# Altium project 724452_RPL-HX_Mobile_AEP_Rev0p91.PrjPcb (part 4 of 13)

## Sheet 0021_Processor PD BOM -.SchDoc
size A3
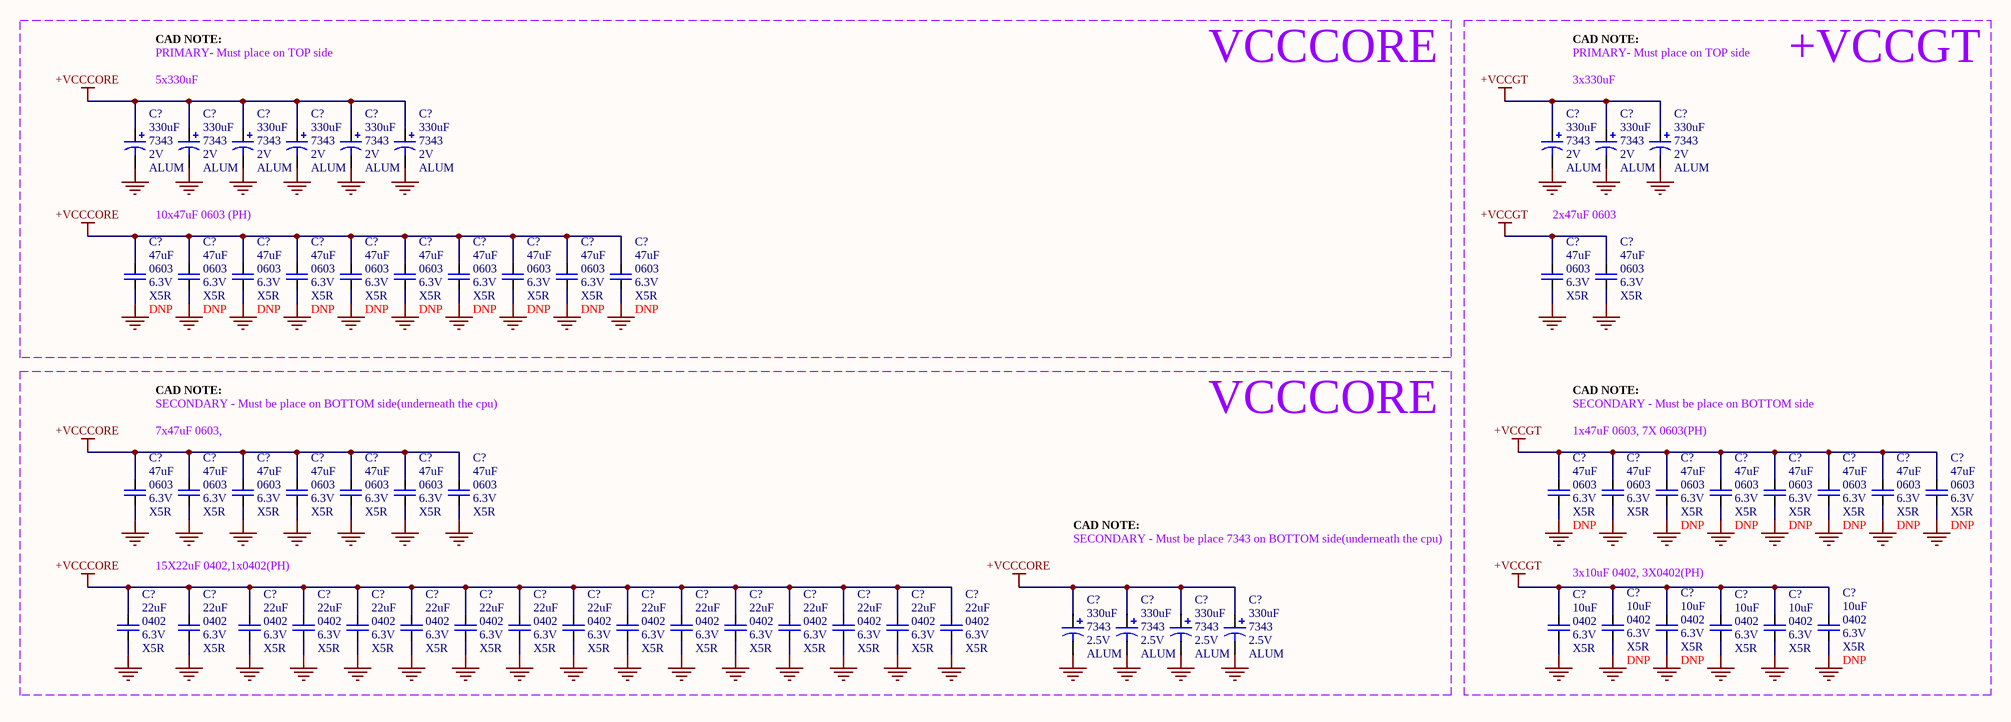
[diagram p47: 0021_Processor PD BOM -.SchDoc]

### Parts
(Parts that share a designator on the sheet are numbered #1, #2 ... from top to bottom, then left to right.)
C?#18  value 330uF  Case/Package: 7343  Voltage: 2V  Dielectric: ALUM  [CAPC_CASE-D2_7343_1.5]  (hidden comment: cap_polar)
C?#19  value 330uF  Case/Package: 7343  Voltage: 2V  Dielectric: ALUM  [CAPC_CASE-D2_7343_1.5]  (hidden comment: cap_polar)
C?#20  value 330uF  Case/Package: 7343  Voltage: 2V  Dielectric: ALUM  [CAPC_CASE-D2_7343_1.5]  (hidden comment: cap_polar)
C?#21  value 330uF  Case/Package: 7343  Voltage: 2V  Dielectric: ALUM  [CAPC_CASE-D2_7343_1.5]  (hidden comment: cap_polar)
C?#22  value 330uF  Case/Package: 7343  Voltage: 2V  Dielectric: ALUM  [CAPC_CASE-D2_7343_1.5]  (hidden comment: cap_polar)
C?#23  value 330uF  Case/Package: 7343  Voltage: 2V  Dielectric: ALUM  [CAPC_CASE-D2_7343_1.5]  (hidden comment: cap_polar)
C?#24  value 330uF  Case/Package: 7343  Voltage: 2V  Dielectric: ALUM  [CAPC_CASE-D2_7343_1.5]  (hidden comment: cap_polar)
C?#25  value 330uF  Case/Package: 7343  Voltage: 2V  Dielectric: ALUM  [CAPC_CASE-D2_7343_1.5]  (hidden comment: cap_polar)
C?#26  value 330uF  Case/Package: 7343  Voltage: 2V  Dielectric: ALUM  [CAPC_CASE-D2_7343_1.5]  (hidden comment: cap_polar)
C?#27  value 47uF  Case/Package: 0603  Voltage: 6.3V  Dielectric: X5R  [capc0603]
C?#28  value 47uF  Case/Package: 0603  Voltage: 6.3V  Dielectric: X5R  [capc0603]
C?#29  value 47uF  Case/Package: 0603  Voltage: 6.3V  Dielectric: X5R  [capc0603]
C?#30  value 47uF  Case/Package: 0603  Voltage: 6.3V  Dielectric: X5R  [capc0603]
C?#31  value 47uF  Case/Package: 0603  Voltage: 6.3V  Dielectric: X5R  [capc0603]
C?#32  value 47uF  Case/Package: 0603  Voltage: 6.3V  Dielectric: X5R  [capc0603]
C?#33  value 47uF  Case/Package: 0603  Voltage: 6.3V  Dielectric: X5R  [capc0603]
C?#34  value 47uF  Case/Package: 0603  Voltage: 6.3V  Dielectric: X5R  [capc0603]
C?#35  value 47uF  Case/Package: 0603  Voltage: 6.3V  Dielectric: X5R  [capc0603]
C?#36  value 47uF  Case/Package: 0603  Voltage: 6.3V  Dielectric: X5R  [capc0603]
C?#37  value 47uF  Case/Package: 0603  Voltage: 6.3V  Dielectric: X5R  [capc0603]
C?#38  value 47uF  Case/Package: 0603  Voltage: 6.3V  Dielectric: X5R  [capc0603]
C?#39  value 47uF  Case/Package: 0603  Voltage: 6.3V  Dielectric: X5R  [capc0603]
C?#40  value 47uF  Case/Package: 0603  Voltage: 6.3V  Dielectric: X5R  [capc0603]
C?#41  value 47uF  Case/Package: 0603  Voltage: 6.3V  Dielectric: X5R  [capc0603]
C?#42  value 47uF  Case/Package: 0603  Voltage: 6.3V  Dielectric: X5R  [capc0603]
C?#43  value 47uF  Case/Package: 0603  Voltage: 6.3V  Dielectric: X5R  [capc0603]
C?#44  value 47uF  Case/Package: 0603  Voltage: 6.3V  Dielectric: X5R  [capc0603]
C?#45  value 47uF  Case/Package: 0603  Voltage: 6.3V  Dielectric: X5R  [capc0603]
C?#46  value 47uF  Case/Package: 0603  Voltage: 6.3V  Dielectric: X5R  [capc0603]
C?#47  value 47uF  Case/Package: 0603  Voltage: 6.3V  Dielectric: X5R  [capc0603]
C?#48  value 47uF  Case/Package: 0603  Voltage: 6.3V  Dielectric: X5R  [capc0603]
C?#49  value 47uF  Case/Package: 0603  Voltage: 6.3V  Dielectric: X5R  [capc0603]
C?#50  value 47uF  Case/Package: 0603  Voltage: 6.3V  Dielectric: X5R  [capc0603]
C?#51  value 47uF  Case/Package: 0603  Voltage: 6.3V  Dielectric: X5R  [capc0603]
C?#52  value 47uF  Case/Package: 0603  Voltage: 6.3V  Dielectric: X5R  [capc0603]
C?#53  value 47uF  Case/Package: 0603  Voltage: 6.3V  Dielectric: X5R  [capc0603]
C?#54  value 330uF  Case/Package: 7343  Voltage: 2.5V  Dielectric: ALUM  [CAPC_CASE-D2_7343_1.5]  (hidden comment: cap_polar)
C?#55  value 330uF  Case/Package: 7343  Voltage: 2.5V  Dielectric: ALUM  [CAPC_CASE-D2_7343_1.5]  (hidden comment: cap_polar)
C?#56  value 330uF  Case/Package: 7343  Voltage: 2.5V  Dielectric: ALUM  [CAPC_CASE-D2_7343_1.5]  (hidden comment: cap_polar)
C?#57  value 330uF  Case/Package: 7343  Voltage: 2.5V  Dielectric: ALUM  [CAPC_CASE-D2_7343_1.5]  (hidden comment: cap_polar)
C?#58  value 22uF  Case/Package: 0402  Voltage: 6.3V  Dielectric: X5R  [CAPC0402]
C?#59  value 22uF  Case/Package: 0402  Voltage: 6.3V  Dielectric: X5R  [CAPC0402]
C?#60  value 22uF  Case/Package: 0402  Voltage: 6.3V  Dielectric: X5R  [CAPC0402]
C?#61  value 22uF  Case/Package: 0402  Voltage: 6.3V  Dielectric: X5R  [CAPC0402]
C?#62  value 22uF  Case/Package: 0402  Voltage: 6.3V  Dielectric: X5R  [CAPC0402]
C?#63  value 22uF  Case/Package: 0402  Voltage: 6.3V  Dielectric: X5R  [CAPC0402]
C?#64  value 22uF  Case/Package: 0402  Voltage: 6.3V  Dielectric: X5R  [CAPC0402]
C?#65  value 22uF  Case/Package: 0402  Voltage: 6.3V  Dielectric: X5R  [CAPC0402]
C?#66  value 22uF  Case/Package: 0402  Voltage: 6.3V  Dielectric: X5R  [CAPC0402]
C?#67  value 22uF  Case/Package: 0402  Voltage: 6.3V  Dielectric: X5R  [CAPC0402]
C?#68  value 22uF  Case/Package: 0402  Voltage: 6.3V  Dielectric: X5R  [CAPC0402]
C?#69  value 22uF  Case/Package: 0402  Voltage: 6.3V  Dielectric: X5R  [CAPC0402]
C?#70  value 22uF  Case/Package: 0402  Voltage: 6.3V  Dielectric: X5R  [CAPC0402]
C?#71  value 22uF  Case/Package: 0402  Voltage: 6.3V  Dielectric: X5R  [CAPC0402]
C?#72  value 22uF  Case/Package: 0402  Voltage: 6.3V  Dielectric: X5R  [CAPC0402]
C?#73  value 22uF  Case/Package: 0402  Voltage: 6.3V  Dielectric: X5R  [CAPC0402]
C?#74  value 10uF  Case/Package: 0402  Voltage: 6.3V  Dielectric: X5R  [CAPC0402]
C?#75  value 10uF  Case/Package: 0402  Voltage: 6.3V  Dielectric: X5R  [CAPC0402]
C?#76  value 10uF  Case/Package: 0402  Voltage: 6.3V  Dielectric: X5R  [CAPC0402]
C?#77  value 10uF  Case/Package: 0402  Voltage: 6.3V  Dielectric: X5R  [CAPC0402]
C?#78  value 10uF  Case/Package: 0402  Voltage: 6.3V  Dielectric: X5R  [CAPC0402]
C?#79  value 10uF  Case/Package: 0402  Voltage: 6.3V  Dielectric: X5R  [CAPC0402]

### Nets
+VCCCORE: C?#18.1(+) C?#19.1(+) C?#20.1(+) C?#21.1(+) C?#22.1(+) C?#23.1(+) C?#27.1 C?#28.1 C?#29.1 C?#30.1 C?#31.1 C?#32.1 C?#33.1 C?#34.1 C?#35.1 C?#36.1 C?#39.1 C?#40.1 C?#41.1 C?#42.1 C?#43.1 C?#44.1 C?#45.1 C?#54.1(+) C?#55.1(+) C?#56.1(+) C?#57.1(+) C?#58.1 C?#59.1 C?#60.1 C?#61.1 C?#62.1 C?#63.1 C?#64.1 C?#65.1 C?#66.1 C?#67.1 C?#68.1 C?#69.1 C?#70.1 C?#71.1 C?#72.1 C?#73.1
+VCCGT: C?#24.1(+) C?#25.1(+) C?#26.1(+) C?#37.1 C?#38.1 C?#46.1 C?#47.1 C?#48.1 C?#49.1 C?#50.1 C?#51.1 C?#52.1 C?#53.1 C?#74.1 C?#75.1 C?#76.1 C?#77.1 C?#78.1 C?#79.1
GND: C?#18.2 C?#19.2 C?#20.2 C?#21.2 C?#22.2 C?#23.2 C?#24.2 C?#25.2 C?#26.2 C?#27.2 C?#28.2 C?#29.2 C?#30.2 C?#31.2 C?#32.2 C?#33.2 C?#34.2 C?#35.2 C?#36.2 C?#37.2 C?#38.2 C?#39.2 C?#40.2 C?#41.2 C?#42.2 C?#43.2 C?#44.2 C?#45.2 C?#46.2 C?#47.2 C?#48.2 C?#49.2 C?#50.2 C?#51.2 C?#52.2 C?#53.2 C?#54.2 C?#55.2 C?#56.2 C?#57.2 C?#58.2 C?#59.2 C?#60.2 C?#61.2 C?#62.2 C?#63.2 C?#64.2 C?#65.2 C?#66.2 C?#67.2 C?#68.2 C?#69.2 C?#70.2 C?#71.2 C?#72.2 C?#73.2 C?#74.2 C?#75.2 C?#76.2 C?#77.2 C?#78.2 C?#79.2  [project net EXP_A_RX_4_DP]

### Notes on the sheet
- CAD NOTE:
- PRIMARY- Must place on TOP side
- 5x330uF
- VCCCORE
- 3x330uF
- +VCCGT
- (near C?#28) 10x47uF 0603 (PH)
- (near C?#37) 2x47uF 0603
- SECONDARY - Must be place on BOTTOM side(underneath the cpu)
- (near C?#40) 7x47uF 0603,
- (near C?#48) 1x47uF 0603, 7X 0603(PH)
- SECONDARY - Must be place on BOTTOM side
- (near C?#59) 15X22uF 0402,1x0402(PH)
- SECONDARY - Must be place 7343 on BOTTOM side(underneath the cpu)
- (near C?#75) 3x10uF 0402, 3X0402(PH)

### Library data of the parts
C?#18-C?#26 = cap_polar: CAP ALUM POLY 330UF 2V 7343; Manufacturer Part Number: EEF-ST0D331R; Type: Polymer
C?#27-C?#53 = Cap: CAP CER 47uF 6.3V X5R 0603
  C?#27-C?#36 C?#46 C?#48-C?#53: DNP: DNP
C?#54-C?#57 = cap_polar: CAP ALUM POLY 330UF 2.5V 7343; Manufacturer Part Number: EEF-ST0D331R; Type: Polymer
C?#58-C?#79 = Cap: CAP CER 10uF 6.3V X5R 0402
  C?#75 C?#76 C?#79: DNP: DNP

## Sheet 0022_Processor - CPU ST.SchDoc
size A3
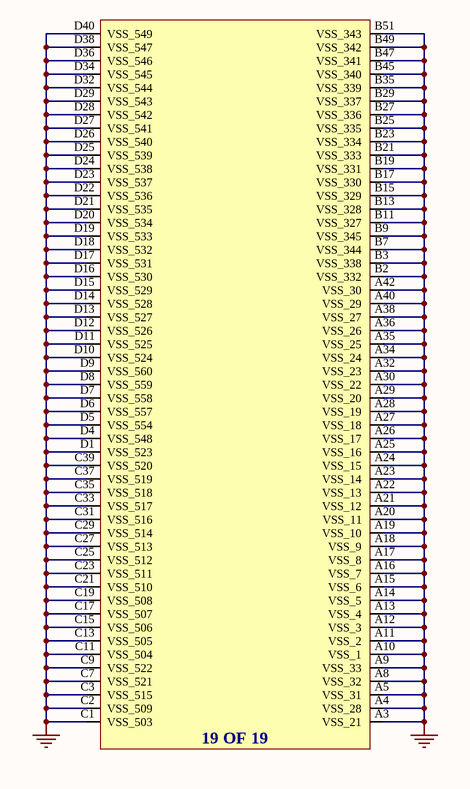
[diagram p48: 0022_Processor - CPU ST.SchDoc]

### Parts
U1401  C_RPL_HX_EXT  (value not drawn)  (part S of 19)

### Nets
GND: U1401.A3(VSS_21) U1401.A4(VSS_28) U1401.A5(VSS_31) U1401.A8(VSS_32) U1401.A9(VSS_33) U1401.A10(VSS_1) U1401.A11(VSS_2) U1401.A12(VSS_3) U1401.A13(VSS_4) U1401.A14(VSS_5) U1401.A15(VSS_6) U1401.A16(VSS_7) U1401.A17(VSS_8) U1401.A18(VSS_9) U1401.A19(VSS_10) U1401.A20(VSS_11) U1401.A21(VSS_12) U1401.A22(VSS_13) U1401.A23(VSS_14) U1401.A24(VSS_15) U1401.A25(VSS_16) U1401.A26(VSS_17) U1401.A27(VSS_18) U1401.A28(VSS_19) U1401.A29(VSS_20) U1401.A30(VSS_22) U1401.A32(VSS_23) U1401.A34(VSS_24) U1401.A35(VSS_25) U1401.A36(VSS_26) U1401.A38(VSS_27) U1401.A40(VSS_29) U1401.A42(VSS_30) U1401.B2(VSS_332) U1401.B3(VSS_338) U1401.B7(VSS_344) U1401.B9(VSS_345) U1401.B11(VSS_327) U1401.B13(VSS_328) U1401.B15(VSS_329) U1401.B17(VSS_330) U1401.B19(VSS_331) U1401.B21(VSS_333) U1401.B23(VSS_334) U1401.B25(VSS_335) U1401.B27(VSS_336) U1401.B29(VSS_337) U1401.B35(VSS_339) U1401.B45(VSS_340) U1401.B47(VSS_341) U1401.B49(VSS_342) U1401.B51(VSS_343) U1401.C1(VSS_503) U1401.C2(VSS_509) U1401.C3(VSS_515) U1401.C7(VSS_521) U1401.C9(VSS_522) U1401.C11(VSS_504) U1401.C13(VSS_505) U1401.C15(VSS_506) U1401.C17(VSS_507) U1401.C19(VSS_508) U1401.C21(VSS_510) U1401.C23(VSS_511) U1401.C25(VSS_512) U1401.C27(VSS_513) U1401.C29(VSS_514) U1401.C31(VSS_516) U1401.C33(VSS_517) U1401.C35(VSS_518) U1401.C37(VSS_519) U1401.C39(VSS_520) U1401.D1(VSS_523) U1401.D4(VSS_548) U1401.D5(VSS_554) U1401.D6(VSS_557) U1401.D7(VSS_558) U1401.D8(VSS_559) U1401.D9(VSS_560) U1401.D10(VSS_524) U1401.D11(VSS_525) U1401.D12(VSS_526) U1401.D13(VSS_527) U1401.D14(VSS_528) U1401.D15(VSS_529) U1401.D16(VSS_530) U1401.D17(VSS_531) U1401.D18(VSS_532) U1401.D19(VSS_533) U1401.D20(VSS_534) U1401.D21(VSS_535) U1401.D22(VSS_536) U1401.D23(VSS_537) U1401.D24(VSS_538) U1401.D25(VSS_539) U1401.D26(VSS_540) U1401.D27(VSS_541) U1401.D28(VSS_542) U1401.D29(VSS_543) U1401.D32(VSS_544) U1401.D34(VSS_545) U1401.D36(VSS_546) U1401.D38(VSS_547) U1401.D40(VSS_549)  [project net EXP_A_RX_4_DP]

### Notes on the sheet
- (in symbol C_RPL_HX_EXT, part S) 19 OF 19

## Sheet 0024_DDR5 SODIMM CONTRO.SchDoc
size A3
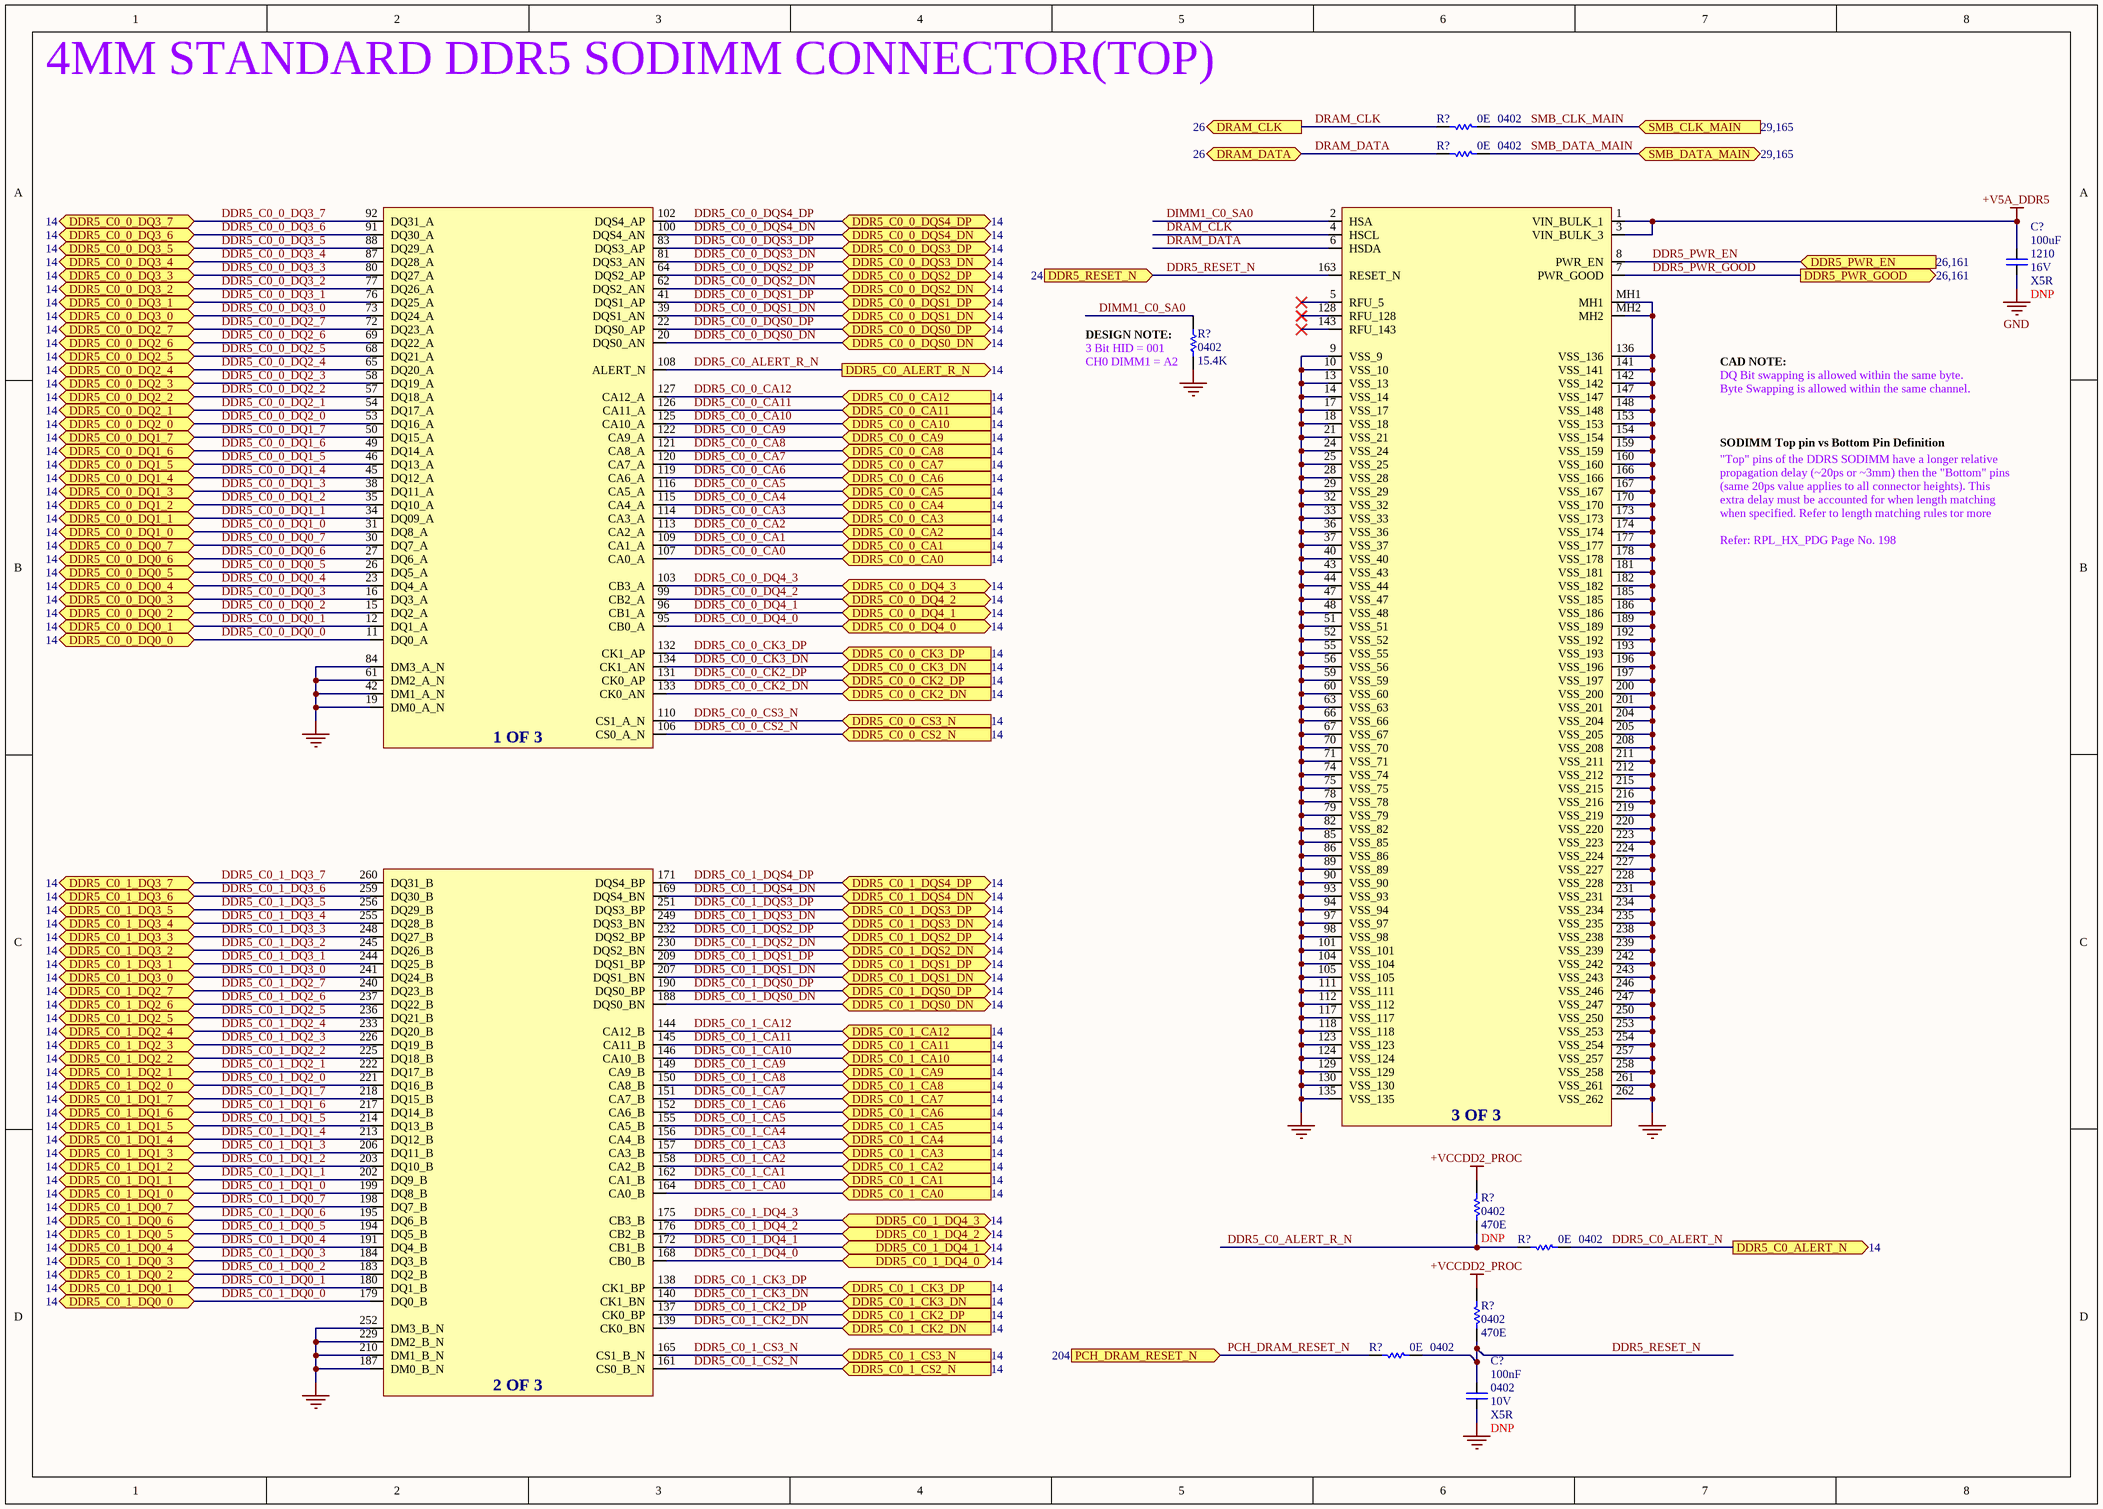
[diagram p49: 0024_DDR5 SODIMM CONTRO.SchDoc]

### Parts
(Parts that share a designator on the sheet are numbered #1, #2 ... from top to bottom, then left to right.)
C?#80  value 100uF  Case/Package: 1210  Voltage: 16V  Dielectric: X5R
C?#81  value 100nF  Case/Package: 0402  Voltage: 10V  Dielectric: X5R  [CAPC0402]
J2301  C_DDR5_SODIMM_2X131_2EM  (value not drawn)  (parts A,B,C of 3)
R?#43  value 0E  Case/Package: 0402  [RESC0402]  (hidden comment: Res)
R?#44  value 0E  Case/Package: 0402  [RESC0402]  (hidden comment: Res)
R?#45  value 15.4K  Case/Package: 0402  [RESC0402]  (hidden comment: Res)
R?#46  value 470E  Case/Package: 0402  [RESC0402]  (hidden comment: Res)
R?#47  value 0E  Case/Package: 0402  [RESC0402]  (hidden comment: Res)
R?#48  value 470E  Case/Package: 0402  [RESC0402]  (hidden comment: Res)
R?#49  value 0E  Case/Package: 0402  [RESC0402]  (hidden comment: Res)

### Ports
DDR5_C0_0_CA0 (in), DDR5_C0_0_CA1 (in), DDR5_C0_0_CA2 (in), DDR5_C0_0_CA3 (in), DDR5_C0_0_CA4 (in), DDR5_C0_0_CA5 (in), DDR5_C0_0_CA6 (in), DDR5_C0_0_CA7 (in), DDR5_C0_0_CA8 (in), DDR5_C0_0_CA9 (in), DDR5_C0_0_CA10 (in), DDR5_C0_0_CA11 (in), DDR5_C0_0_CA12 (in), DDR5_C0_0_CK2_DN (in), DDR5_C0_0_CK2_DP (in), DDR5_C0_0_CK3_DN (in), DDR5_C0_0_CK3_DP (in), DDR5_C0_0_CS2_N (in), DDR5_C0_0_CS3_N (in), DDR5_C0_0_DQ0_0 (bidir), DDR5_C0_0_DQ0_1 (bidir), DDR5_C0_0_DQ0_2 (bidir), DDR5_C0_0_DQ0_3 (bidir), DDR5_C0_0_DQ0_4 (bidir), DDR5_C0_0_DQ0_5 (bidir), DDR5_C0_0_DQ0_6 (bidir), DDR5_C0_0_DQ0_7 (bidir), DDR5_C0_0_DQ1_0 (bidir), DDR5_C0_0_DQ1_1 (bidir), DDR5_C0_0_DQ1_2 (bidir), DDR5_C0_0_DQ1_3 (bidir), DDR5_C0_0_DQ1_4 (bidir), DDR5_C0_0_DQ1_5 (bidir), DDR5_C0_0_DQ1_6 (bidir), DDR5_C0_0_DQ1_7 (bidir), DDR5_C0_0_DQ2_0 (bidir), DDR5_C0_0_DQ2_1 (bidir), DDR5_C0_0_DQ2_2 (bidir), DDR5_C0_0_DQ2_3 (bidir), DDR5_C0_0_DQ2_4 (bidir), DDR5_C0_0_DQ2_5 (bidir), DDR5_C0_0_DQ2_6 (bidir), DDR5_C0_0_DQ2_7 (bidir), DDR5_C0_0_DQ3_0 (bidir), DDR5_C0_0_DQ3_1 (bidir), DDR5_C0_0_DQ3_2 (bidir), DDR5_C0_0_DQ3_3 (bidir), DDR5_C0_0_DQ3_4 (bidir), DDR5_C0_0_DQ3_5 (bidir), DDR5_C0_0_DQ3_6 (bidir), DDR5_C0_0_DQ3_7 (bidir), DDR5_C0_0_DQ4_0 (bidir), DDR5_C0_0_DQ4_1 (bidir), DDR5_C0_0_DQ4_2 (bidir), DDR5_C0_0_DQ4_3 (bidir), DDR5_C0_0_DQS0_DN (bidir), DDR5_C0_0_DQS0_DP (bidir), DDR5_C0_0_DQS1_DN (bidir), DDR5_C0_0_DQS1_DP (bidir), DDR5_C0_0_DQS2_DN (bidir), DDR5_C0_0_DQS2_DP (bidir), DDR5_C0_0_DQS3_DN (bidir), DDR5_C0_0_DQS3_DP (bidir), DDR5_C0_0_DQS4_DN (bidir), DDR5_C0_0_DQS4_DP (bidir), DDR5_C0_1_CA0 (in), DDR5_C0_1_CA1 (in), DDR5_C0_1_CA2 (in), DDR5_C0_1_CA3 (in), DDR5_C0_1_CA4 (in), DDR5_C0_1_CA5 (in), DDR5_C0_1_CA6 (in), DDR5_C0_1_CA7 (in), DDR5_C0_1_CA8 (in), DDR5_C0_1_CA9 (in), DDR5_C0_1_CA10 (in), DDR5_C0_1_CA11 (in), DDR5_C0_1_CA12 (in), DDR5_C0_1_CK2_DN (in), DDR5_C0_1_CK2_DP (in), DDR5_C0_1_CK3_DN (in), DDR5_C0_1_CK3_DP (in), DDR5_C0_1_CS2_N (in), DDR5_C0_1_CS3_N (in), DDR5_C0_1_DQ0_0 (bidir), DDR5_C0_1_DQ0_1 (bidir), DDR5_C0_1_DQ0_2 (bidir), DDR5_C0_1_DQ0_3 (bidir), DDR5_C0_1_DQ0_4 (bidir), DDR5_C0_1_DQ0_5 (bidir), DDR5_C0_1_DQ0_6 (bidir), DDR5_C0_1_DQ0_7 (bidir), DDR5_C0_1_DQ1_0 (bidir), DDR5_C0_1_DQ1_1 (bidir), DDR5_C0_1_DQ1_2 (bidir), DDR5_C0_1_DQ1_3 (bidir), DDR5_C0_1_DQ1_4 (bidir), DDR5_C0_1_DQ1_5 (bidir), DDR5_C0_1_DQ1_6 (bidir), DDR5_C0_1_DQ1_7 (bidir), DDR5_C0_1_DQ2_0 (bidir), DDR5_C0_1_DQ2_1 (bidir), DDR5_C0_1_DQ2_2 (bidir), DDR5_C0_1_DQ2_3 (bidir), DDR5_C0_1_DQ2_4 (bidir), DDR5_C0_1_DQ2_5 (bidir), DDR5_C0_1_DQ2_6 (bidir), DDR5_C0_1_DQ2_7 (bidir), DDR5_C0_1_DQ3_0 (bidir), DDR5_C0_1_DQ3_1 (bidir), DDR5_C0_1_DQ3_2 (bidir), DDR5_C0_1_DQ3_3 (bidir), DDR5_C0_1_DQ3_4 (bidir), DDR5_C0_1_DQ3_5 (bidir), DDR5_C0_1_DQ3_6 (bidir), DDR5_C0_1_DQ3_7 (bidir), DDR5_C0_1_DQ4_0 (bidir), DDR5_C0_1_DQ4_1 (bidir), DDR5_C0_1_DQ4_2 (bidir), DDR5_C0_1_DQ4_3 (bidir), DDR5_C0_1_DQS0_DN (bidir), DDR5_C0_1_DQS0_DP (bidir), DDR5_C0_1_DQS1_DN (bidir), DDR5_C0_1_DQS1_DP (bidir), DDR5_C0_1_DQS2_DN (bidir), DDR5_C0_1_DQS2_DP (bidir), DDR5_C0_1_DQS3_DN (bidir), DDR5_C0_1_DQS3_DP (bidir), DDR5_C0_1_DQS4_DN (bidir), DDR5_C0_1_DQS4_DP (bidir), DDR5_C0_ALERT_N (out), DDR5_C0_ALERT_R_N (out), DDR5_PWR_EN (in), DDR5_PWR_GOOD (out), DDR5_RESET_N (in), DRAM_CLK (out), DRAM_DATA (bidir), PCH_DRAM_RESET_N (in), SMB_CLK_MAIN (in), SMB_DATA_MAIN (bidir)

### Nets
+V5A_DDR5: C?#80.1 J2301.1(VIN_BULK_1) J2301.3(VIN_BULK_3)
+VCCDD2_PROC: R?#46.2 R?#48.2
GND: C?#80.2 C?#81.2 J2301.9(VSS_9) J2301.10(VSS_10) J2301.13(VSS_13) J2301.14(VSS_14) J2301.17(VSS_17) J2301.18(VSS_18) J2301.19(DM0_A_N) J2301.21(VSS_21) J2301.24(VSS_24) J2301.25(VSS_25) J2301.28(VSS_28) J2301.29(VSS_29) J2301.32(VSS_32) J2301.33(VSS_33) J2301.36(VSS_36) J2301.37(VSS_37) J2301.40(VSS_40) J2301.42(DM1_A_N) J2301.43(VSS_43) J2301.44(VSS_44) J2301.47(VSS_47) J2301.48(VSS_48) J2301.51(VSS_51) J2301.52(VSS_52) J2301.55(VSS_55) J2301.56(VSS_56) J2301.59(VSS_59) J2301.60(VSS_60) J2301.61(DM2_A_N) J2301.63(VSS_63) J2301.66(VSS_66) J2301.67(VSS_67) J2301.70(VSS_70) J2301.71(VSS_71) J2301.74(VSS_74) J2301.75(VSS_75) J2301.78(VSS_78) J2301.79(VSS_79) J2301.82(VSS_82) J2301.84(DM3_A_N) J2301.85(VSS_85) J2301.86(VSS_86) J2301.89(VSS_89) J2301.90(VSS_90) J2301.93(VSS_93) J2301.94(VSS_94) J2301.97(VSS_97) J2301.98(VSS_98) J2301.101(VSS_101) J2301.104(VSS_104) J2301.105(VSS_105) J2301.111(VSS_111) J2301.112(VSS_112) J2301.117(VSS_117) J2301.118(VSS_118) J2301.123(VSS_123) J2301.124(VSS_124) J2301.129(VSS_129) J2301.130(VSS_130) J2301.135(VSS_135) J2301.136(VSS_136) J2301.141(VSS_141) J2301.142(VSS_142) J2301.147(VSS_147) J2301.148(VSS_148) J2301.153(VSS_153) J2301.154(VSS_154) J2301.159(VSS_159) J2301.160(VSS_160) J2301.166(VSS_166) J2301.167(VSS_167) J2301.170(VSS_170) J2301.173(VSS_173) J2301.174(VSS_174) J2301.177(VSS_177) J2301.178(VSS_178) J2301.181(VSS_181) J2301.182(VSS_182) J2301.185(VSS_185) J2301.186(VSS_186) J2301.187(DM0_B_N) J2301.189(VSS_189) J2301.192(VSS_192) J2301.193(VSS_193) J2301.196(VSS_196) J2301.197(VSS_197) J2301.200(VSS_200) J2301.201(VSS_201) J2301.204(VSS_204) J2301.205(VSS_205) J2301.208(VSS_208) J2301.210(DM1_B_N) J2301.211(VSS_211) J2301.212(VSS_212) J2301.215(VSS_215) J2301.216(VSS_216) J2301.219(VSS_219) J2301.220(VSS_220) J2301.223(VSS_223) J2301.224(VSS_224) J2301.227(VSS_227) J2301.228(VSS_228) J2301.229(DM2_B_N) J2301.231(VSS_231) J2301.234(VSS_234) J2301.235(VSS_235) J2301.238(VSS_238) J2301.239(VSS_239) J2301.242(VSS_242) J2301.243(VSS_243) J2301.246(VSS_246) J2301.247(VSS_247) J2301.250(VSS_250) J2301.252(DM3_B_N) J2301.253(VSS_253) J2301.254(VSS_254) J2301.257(VSS_257) J2301.258(VSS_258) J2301.261(VSS_261) J2301.262(VSS_262) J2301.MH1 J2301.MH2 R?#45.2  [project net EXP_A_RX_4_DP]
DDR5_C0_0_CA0: J2301.107(CA0_A) ; port DDR5_C0_0_CA0
DDR5_C0_0_CA1: J2301.109(CA1_A) ; port DDR5_C0_0_CA1
DDR5_C0_0_CA2: J2301.113(CA2_A) ; port DDR5_C0_0_CA2
DDR5_C0_0_CA3: J2301.114(CA3_A) ; port DDR5_C0_0_CA3
DDR5_C0_0_CA4: J2301.115(CA4_A) ; port DDR5_C0_0_CA4
DDR5_C0_0_CA5: J2301.116(CA5_A) ; port DDR5_C0_0_CA5
DDR5_C0_0_CA6: J2301.119(CA6_A) ; port DDR5_C0_0_CA6
DDR5_C0_0_CA7: J2301.120(CA7_A) ; port DDR5_C0_0_CA7
DDR5_C0_0_CA8: J2301.121(CA8_A) ; port DDR5_C0_0_CA8
DDR5_C0_0_CA9: J2301.122(CA9_A) ; port DDR5_C0_0_CA9
DDR5_C0_0_CA10: J2301.125(CA10_A) ; port DDR5_C0_0_CA10
DDR5_C0_0_CA11: J2301.126(CA11_A) ; port DDR5_C0_0_CA11
DDR5_C0_0_CA12: J2301.127(CA12_A) ; port DDR5_C0_0_CA12
DDR5_C0_0_CK2_DN: J2301.133(CK0_AN) ; port DDR5_C0_0_CK2_DN
DDR5_C0_0_CK2_DP: J2301.131(CK0_AP) ; port DDR5_C0_0_CK2_DP
DDR5_C0_0_CK3_DN: J2301.134(CK1_AN) ; port DDR5_C0_0_CK3_DN
DDR5_C0_0_CK3_DP: J2301.132(CK1_AP) ; port DDR5_C0_0_CK3_DP
DDR5_C0_0_CS2_N: J2301.106(CS0_A_N) ; port DDR5_C0_0_CS2_N
DDR5_C0_0_CS3_N: J2301.110(CS1_A_N) ; port DDR5_C0_0_CS3_N
DDR5_C0_0_DQ0_0: J2301.11(DQ0_A) ; port DDR5_C0_0_DQ0_0
DDR5_C0_0_DQ0_1: J2301.12(DQ1_A) ; port DDR5_C0_0_DQ0_1
DDR5_C0_0_DQ0_2: J2301.15(DQ2_A) ; port DDR5_C0_0_DQ0_2
DDR5_C0_0_DQ0_3: J2301.16(DQ3_A) ; port DDR5_C0_0_DQ0_3
DDR5_C0_0_DQ0_4: J2301.23(DQ4_A) ; port DDR5_C0_0_DQ0_4
DDR5_C0_0_DQ0_5: J2301.26(DQ5_A) ; port DDR5_C0_0_DQ0_5
DDR5_C0_0_DQ0_6: J2301.27(DQ6_A) ; port DDR5_C0_0_DQ0_6
DDR5_C0_0_DQ0_7: J2301.30(DQ7_A) ; port DDR5_C0_0_DQ0_7
DDR5_C0_0_DQ1_0: J2301.31(DQ8_A) ; port DDR5_C0_0_DQ1_0
DDR5_C0_0_DQ1_1: J2301.34(DQ09_A) ; port DDR5_C0_0_DQ1_1
DDR5_C0_0_DQ1_2: J2301.35(DQ10_A) ; port DDR5_C0_0_DQ1_2
DDR5_C0_0_DQ1_3: J2301.38(DQ11_A) ; port DDR5_C0_0_DQ1_3
DDR5_C0_0_DQ1_4: J2301.45(DQ12_A) ; port DDR5_C0_0_DQ1_4
DDR5_C0_0_DQ1_5: J2301.46(DQ13_A) ; port DDR5_C0_0_DQ1_5
DDR5_C0_0_DQ1_6: J2301.49(DQ14_A) ; port DDR5_C0_0_DQ1_6
DDR5_C0_0_DQ1_7: J2301.50(DQ15_A) ; port DDR5_C0_0_DQ1_7
DDR5_C0_0_DQ2_0: J2301.53(DQ16_A) ; port DDR5_C0_0_DQ2_0
DDR5_C0_0_DQ2_1: J2301.54(DQ17_A) ; port DDR5_C0_0_DQ2_1
DDR5_C0_0_DQ2_2: J2301.57(DQ18_A) ; port DDR5_C0_0_DQ2_2
DDR5_C0_0_DQ2_3: J2301.58(DQ19_A) ; port DDR5_C0_0_DQ2_3
DDR5_C0_0_DQ2_4: J2301.65(DQ20_A) ; port DDR5_C0_0_DQ2_4
DDR5_C0_0_DQ2_5: J2301.68(DQ21_A) ; port DDR5_C0_0_DQ2_5
DDR5_C0_0_DQ2_6: J2301.69(DQ22_A) ; port DDR5_C0_0_DQ2_6
DDR5_C0_0_DQ2_7: J2301.72(DQ23_A) ; port DDR5_C0_0_DQ2_7
DDR5_C0_0_DQ3_0: J2301.73(DQ24_A) ; port DDR5_C0_0_DQ3_0
DDR5_C0_0_DQ3_1: J2301.76(DQ25_A) ; port DDR5_C0_0_DQ3_1
DDR5_C0_0_DQ3_2: J2301.77(DQ26_A) ; port DDR5_C0_0_DQ3_2
DDR5_C0_0_DQ3_3: J2301.80(DQ27_A) ; port DDR5_C0_0_DQ3_3
DDR5_C0_0_DQ3_4: J2301.87(DQ28_A) ; port DDR5_C0_0_DQ3_4
DDR5_C0_0_DQ3_5: J2301.88(DQ29_A) ; port DDR5_C0_0_DQ3_5
DDR5_C0_0_DQ3_6: J2301.91(DQ30_A) ; port DDR5_C0_0_DQ3_6
DDR5_C0_0_DQ3_7: J2301.92(DQ31_A) ; port DDR5_C0_0_DQ3_7
DDR5_C0_0_DQ4_0: J2301.95(CB0_A) ; port DDR5_C0_0_DQ4_0
DDR5_C0_0_DQ4_1: J2301.96(CB1_A) ; port DDR5_C0_0_DQ4_1
DDR5_C0_0_DQ4_2: J2301.99(CB2_A) ; port DDR5_C0_0_DQ4_2
DDR5_C0_0_DQ4_3: J2301.103(CB3_A) ; port DDR5_C0_0_DQ4_3
DDR5_C0_0_DQS0_DN: J2301.20(DQS0_AN) ; port DDR5_C0_0_DQS0_DN
DDR5_C0_0_DQS0_DP: J2301.22(DQS0_AP) ; port DDR5_C0_0_DQS0_DP
DDR5_C0_0_DQS1_DN: J2301.39(DQS1_AN) ; port DDR5_C0_0_DQS1_DN
DDR5_C0_0_DQS1_DP: J2301.41(DQS1_AP) ; port DDR5_C0_0_DQS1_DP
DDR5_C0_0_DQS2_DN: J2301.62(DQS2_AN) ; port DDR5_C0_0_DQS2_DN
DDR5_C0_0_DQS2_DP: J2301.64(DQS2_AP) ; port DDR5_C0_0_DQS2_DP
DDR5_C0_0_DQS3_DN: J2301.81(DQS3_AN) ; port DDR5_C0_0_DQS3_DN
DDR5_C0_0_DQS3_DP: J2301.83(DQS3_AP) ; port DDR5_C0_0_DQS3_DP
DDR5_C0_0_DQS4_DN: J2301.100(DQS4_AN) ; port DDR5_C0_0_DQS4_DN
DDR5_C0_0_DQS4_DP: J2301.102(DQS4_AP) ; port DDR5_C0_0_DQS4_DP
DDR5_C0_1_CA0: J2301.164(CA0_B) ; port DDR5_C0_1_CA0
DDR5_C0_1_CA1: J2301.162(CA1_B) ; port DDR5_C0_1_CA1
DDR5_C0_1_CA2: J2301.158(CA2_B) ; port DDR5_C0_1_CA2
DDR5_C0_1_CA3: J2301.157(CA3_B) ; port DDR5_C0_1_CA3
DDR5_C0_1_CA4: J2301.156(CA4_B) ; port DDR5_C0_1_CA4
DDR5_C0_1_CA5: J2301.155(CA5_B) ; port DDR5_C0_1_CA5
DDR5_C0_1_CA6: J2301.152(CA6_B) ; port DDR5_C0_1_CA6
DDR5_C0_1_CA7: J2301.151(CA7_B) ; port DDR5_C0_1_CA7
DDR5_C0_1_CA8: J2301.150(CA8_B) ; port DDR5_C0_1_CA8
DDR5_C0_1_CA9: J2301.149(CA9_B) ; port DDR5_C0_1_CA9
DDR5_C0_1_CA10: J2301.146(CA10_B) ; port DDR5_C0_1_CA10
DDR5_C0_1_CA11: J2301.145(CA11_B) ; port DDR5_C0_1_CA11
DDR5_C0_1_CA12: J2301.144(CA12_B) ; port DDR5_C0_1_CA12
DDR5_C0_1_CK2_DN: J2301.139(CK0_BN) ; port DDR5_C0_1_CK2_DN
DDR5_C0_1_CK2_DP: J2301.137(CK0_BP) ; port DDR5_C0_1_CK2_DP
DDR5_C0_1_CK3_DN: J2301.140(CK1_BN) ; port DDR5_C0_1_CK3_DN
DDR5_C0_1_CK3_DP: J2301.138(CK1_BP) ; port DDR5_C0_1_CK3_DP
DDR5_C0_1_CS2_N: J2301.161(CS0_B_N) ; port DDR5_C0_1_CS2_N
DDR5_C0_1_CS3_N: J2301.165(CS1_B_N) ; port DDR5_C0_1_CS3_N
DDR5_C0_1_DQ0_0: J2301.179(DQ0_B) ; port DDR5_C0_1_DQ0_0
DDR5_C0_1_DQ0_1: J2301.180(DQ1_B) ; port DDR5_C0_1_DQ0_1
DDR5_C0_1_DQ0_2: J2301.183(DQ2_B) ; port DDR5_C0_1_DQ0_2
DDR5_C0_1_DQ0_3: J2301.184(DQ3_B) ; port DDR5_C0_1_DQ0_3
DDR5_C0_1_DQ0_4: J2301.191(DQ4_B) ; port DDR5_C0_1_DQ0_4
DDR5_C0_1_DQ0_5: J2301.194(DQ5_B) ; port DDR5_C0_1_DQ0_5
DDR5_C0_1_DQ0_6: J2301.195(DQ6_B) ; port DDR5_C0_1_DQ0_6
DDR5_C0_1_DQ0_7: J2301.198(DQ7_B) ; port DDR5_C0_1_DQ0_7
DDR5_C0_1_DQ1_0: J2301.199(DQ8_B) ; port DDR5_C0_1_DQ1_0
DDR5_C0_1_DQ1_1: J2301.202(DQ9_B) ; port DDR5_C0_1_DQ1_1
DDR5_C0_1_DQ1_2: J2301.203(DQ10_B) ; port DDR5_C0_1_DQ1_2
DDR5_C0_1_DQ1_3: J2301.206(DQ11_B) ; port DDR5_C0_1_DQ1_3
DDR5_C0_1_DQ1_4: J2301.213(DQ12_B) ; port DDR5_C0_1_DQ1_4
DDR5_C0_1_DQ1_5: J2301.214(DQ13_B) ; port DDR5_C0_1_DQ1_5
DDR5_C0_1_DQ1_6: J2301.217(DQ14_B) ; port DDR5_C0_1_DQ1_6
DDR5_C0_1_DQ1_7: J2301.218(DQ15_B) ; port DDR5_C0_1_DQ1_7
DDR5_C0_1_DQ2_0: J2301.221(DQ16_B) ; port DDR5_C0_1_DQ2_0
DDR5_C0_1_DQ2_1: J2301.222(DQ17_B) ; port DDR5_C0_1_DQ2_1
DDR5_C0_1_DQ2_2: J2301.225(DQ18_B) ; port DDR5_C0_1_DQ2_2
DDR5_C0_1_DQ2_3: J2301.226(DQ19_B) ; port DDR5_C0_1_DQ2_3
DDR5_C0_1_DQ2_4: J2301.233(DQ20_B) ; port DDR5_C0_1_DQ2_4
DDR5_C0_1_DQ2_5: J2301.236(DQ21_B) ; port DDR5_C0_1_DQ2_5
DDR5_C0_1_DQ2_6: J2301.237(DQ22_B) ; port DDR5_C0_1_DQ2_6
DDR5_C0_1_DQ2_7: J2301.240(DQ23_B) ; port DDR5_C0_1_DQ2_7
DDR5_C0_1_DQ3_0: J2301.241(DQ24_B) ; port DDR5_C0_1_DQ3_0
DDR5_C0_1_DQ3_1: J2301.244(DQ25_B) ; port DDR5_C0_1_DQ3_1
DDR5_C0_1_DQ3_2: J2301.245(DQ26_B) ; port DDR5_C0_1_DQ3_2
DDR5_C0_1_DQ3_3: J2301.248(DQ27_B) ; port DDR5_C0_1_DQ3_3
DDR5_C0_1_DQ3_4: J2301.255(DQ28_B) ; port DDR5_C0_1_DQ3_4
DDR5_C0_1_DQ3_5: J2301.256(DQ29_B) ; port DDR5_C0_1_DQ3_5
DDR5_C0_1_DQ3_6: J2301.259(DQ30_B) ; port DDR5_C0_1_DQ3_6
DDR5_C0_1_DQ3_7: J2301.260(DQ31_B) ; port DDR5_C0_1_DQ3_7
DDR5_C0_1_DQ4_0: J2301.168(CB0_B) ; port DDR5_C0_1_DQ4_0
DDR5_C0_1_DQ4_1: J2301.172(CB1_B) ; port DDR5_C0_1_DQ4_1
DDR5_C0_1_DQ4_2: J2301.176(CB2_B) ; port DDR5_C0_1_DQ4_2
DDR5_C0_1_DQ4_3: J2301.175(CB3_B) ; port DDR5_C0_1_DQ4_3
DDR5_C0_1_DQS0_DN: J2301.188(DQS0_BN) ; port DDR5_C0_1_DQS0_DN
DDR5_C0_1_DQS0_DP: J2301.190(DQS0_BP) ; port DDR5_C0_1_DQS0_DP
DDR5_C0_1_DQS1_DN: J2301.207(DQS1_BN) ; port DDR5_C0_1_DQS1_DN
DDR5_C0_1_DQS1_DP: J2301.209(DQS1_BP) ; port DDR5_C0_1_DQS1_DP
DDR5_C0_1_DQS2_DN: J2301.230(DQS2_BN) ; port DDR5_C0_1_DQS2_DN
DDR5_C0_1_DQS2_DP: J2301.232(DQS2_BP) ; port DDR5_C0_1_DQS2_DP
DDR5_C0_1_DQS3_DN: J2301.249(DQS3_BN) ; port DDR5_C0_1_DQS3_DN
DDR5_C0_1_DQS3_DP: J2301.251(DQS3_BP) ; port DDR5_C0_1_DQS3_DP
DDR5_C0_1_DQS4_DN: J2301.169(DQS4_BN) ; port DDR5_C0_1_DQS4_DN
DDR5_C0_1_DQS4_DP: J2301.171(DQS4_BP) ; port DDR5_C0_1_DQS4_DP
DDR5_C0_ALERT_N: R?#47.2 ; port DDR5_C0_ALERT_N
DDR5_C0_ALERT_R_N: J2301.108(ALERT_N) R?#46.1 R?#47.1 ; port DDR5_C0_ALERT_R_N
DDR5_PWR_EN: J2301.8(PWR_EN) ; port DDR5_PWR_EN
DDR5_PWR_GOOD: J2301.7(PWR_GOOD) ; port DDR5_PWR_GOOD
DDR5_RESET_N: C?#81.1 J2301.163(RESET_N) R?#48.1 R?#49.2 ; port DDR5_RESET_N
DIMM1_C0_SA0: J2301.2(HSA) R?#45.1
DRAM_CLK: J2301.4(HSCL) R?#43.1 ; port DRAM_CLK
DRAM_DATA: J2301.6(HSDA) R?#44.1 ; port DRAM_DATA
PCH_DRAM_RESET_N: R?#49.1 ; port PCH_DRAM_RESET_N
SMB_CLK_MAIN: R?#43.2 ; port SMB_CLK_MAIN
SMB_DATA_MAIN: R?#44.2 ; port SMB_DATA_MAIN

Not connected (* = marked no-connect by the designer): J2301 5(RFU_5)* 128(RFU_128)* 143(RFU_143)*

### Notes on the sheet
- 4MM STANDARD DDR5 SODIMM CONNECTOR(TOP)
- (near R?#45) DESIGN NOTE:
- (near R?#45) 3 Bit HID = 001
- (near R?#45) CH0 DIMM1 = A2
- CAD NOTE:
- DQ Bit swapping is allowed within the same byte.
- Byte Swapping is allowed within the same channel.
- SODIMM Top pin vs Bottom Pin Definition
- "Top" pins of the DDRS SODIMM have a longer relative propagation delay (~20ps or ~3mm) then the "Bottom" pins (same 20ps value applies to all connector heights). This extra delay must be accounted for when length matching when specified. Refer to length matching rules tor more details
- Refer: RPL_HX_PDG Page No. 198
- (in symbol C_DDR5_SODIMM_2X131_2EM, part A) 1 OF 3
- (in symbol C_DDR5_SODIMM_2X131_2EM, part B) 2 OF 3
- (in symbol C_DDR5_SODIMM_2X131_2EM, part C) 3 OF 3

### Library data of the parts
C?#80 = Cap: CAP CER 100uF 16V X5R 1210; DNP: DNP
C?#81 = Cap: CAP CER 100nF 10V X5R 0402; DNP: DNP
R?#43 R?#44 R?#47 R?#49 = Res: Thick Film Resistor -  0ohm, 1%, 0402
R?#45 = Res: Thick Film Resistor -  15.4Kohm, 1%, 0402
R?#46 R?#48 = Res: Thick Film Resistor -  470ohm, 1%, 0402
  R?#46: DNP: DNP
J2301 = C_DDR5_SODIMM_2X131_2EM: Manufacturer Part Number: *; Case/Package: *

## Sheet 0026_DDR5 SODIMM CONTRO.SchDoc
size A3
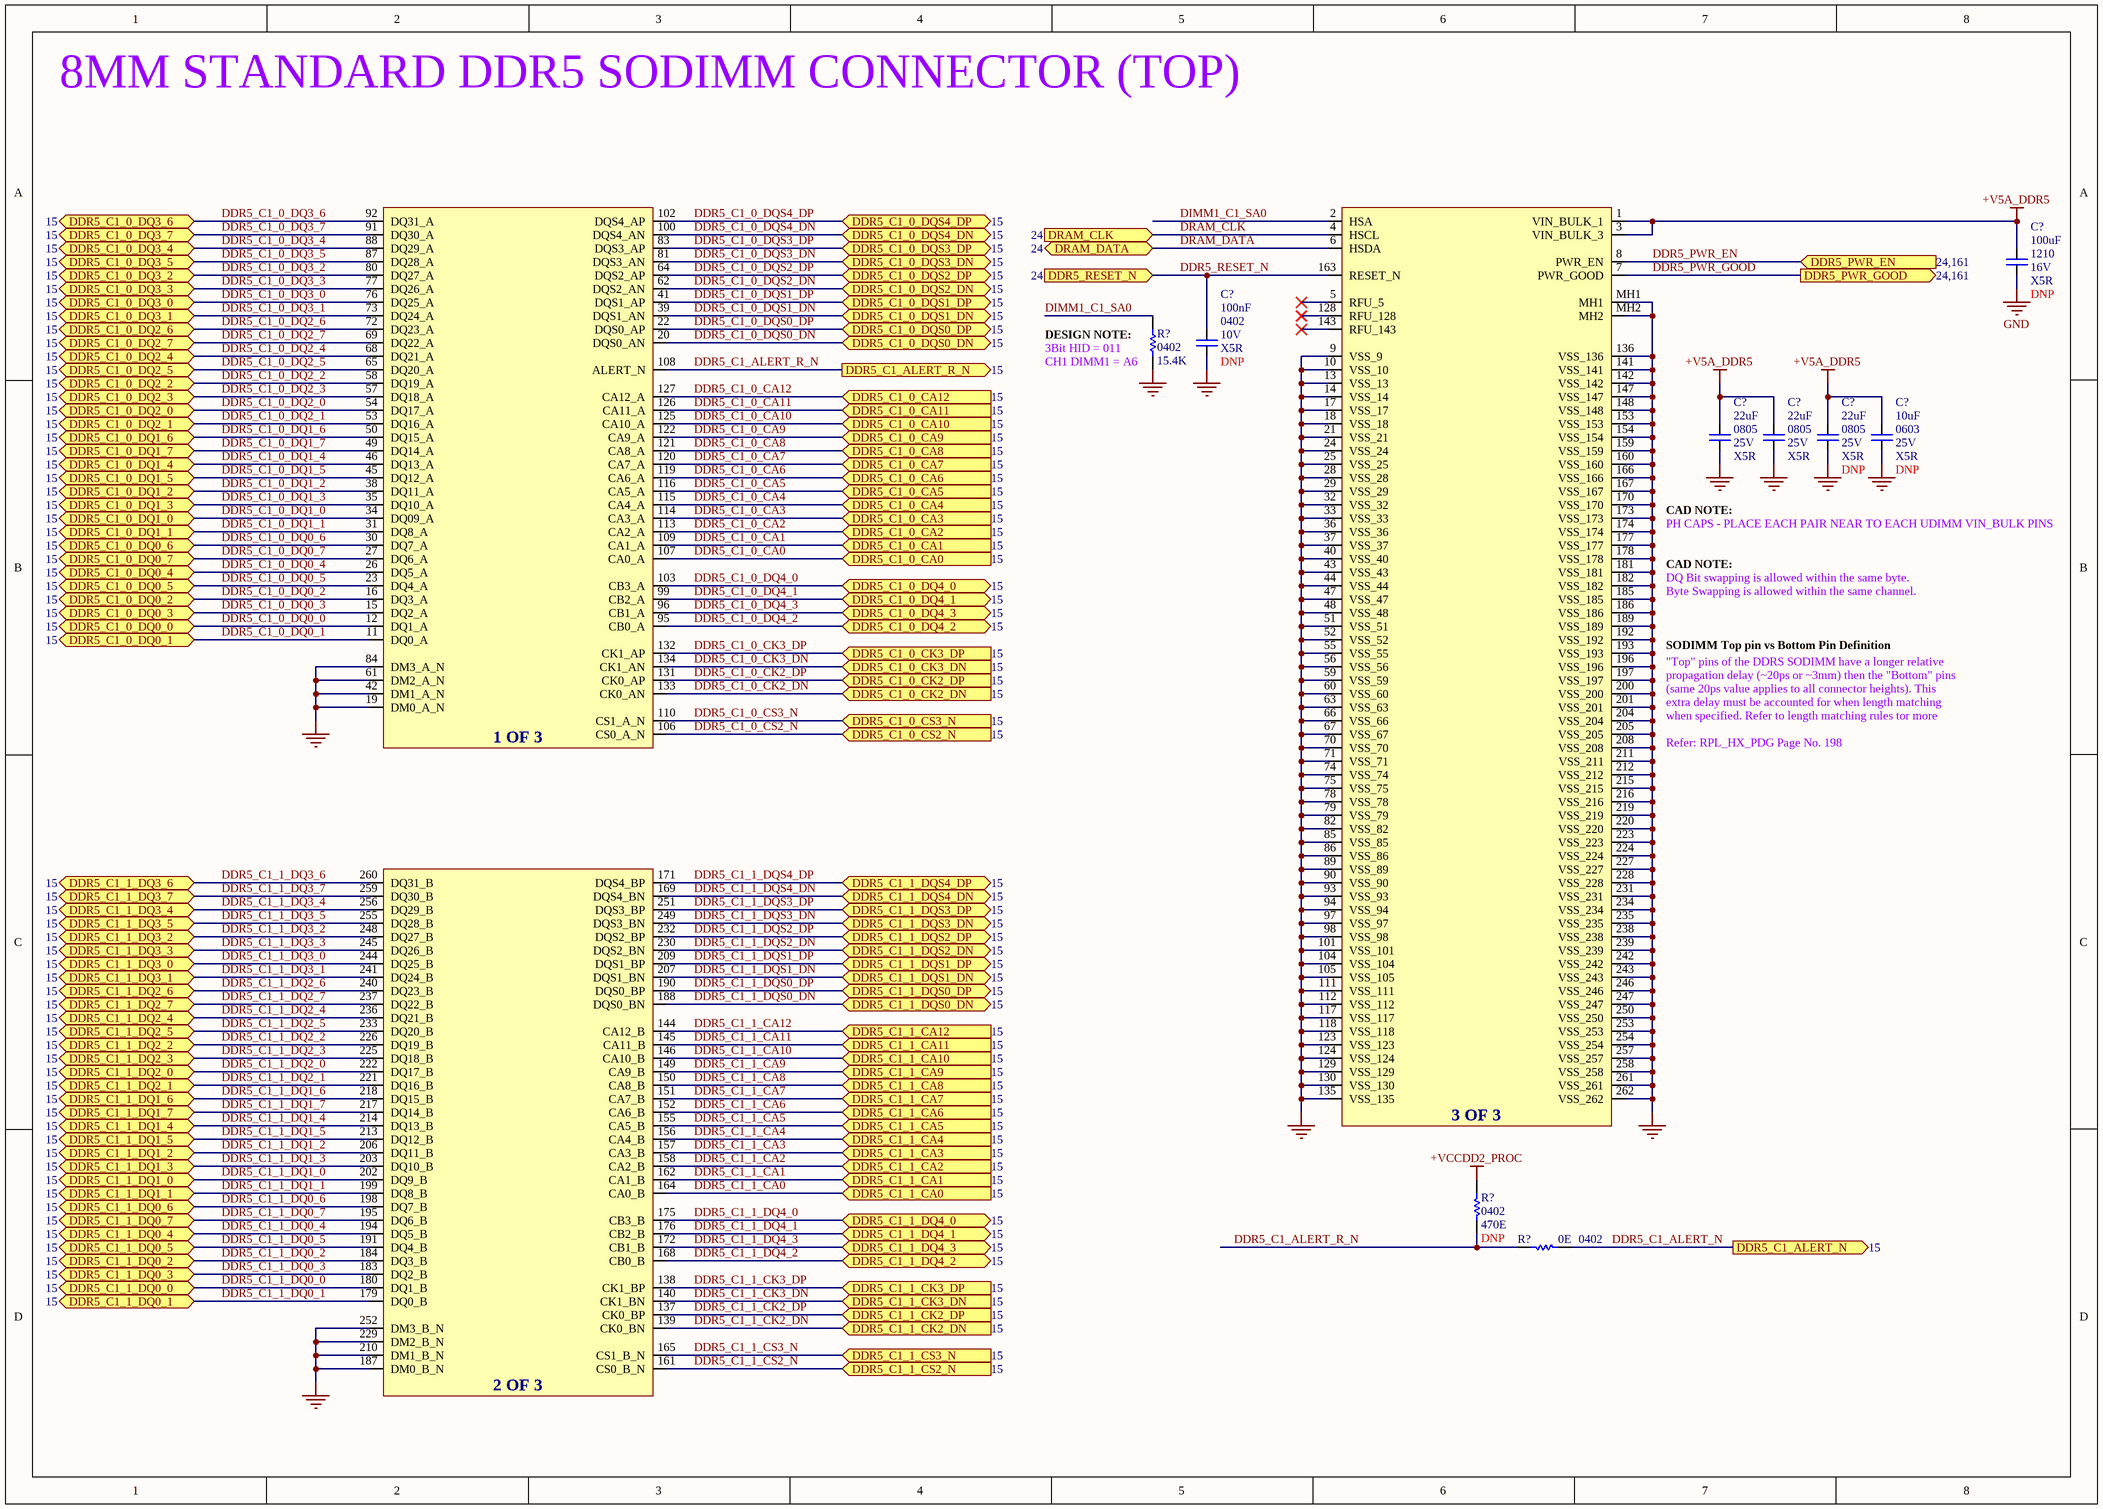
[diagram p50: 0026_DDR5 SODIMM CONTRO.SchDoc]

### Parts
(Parts that share a designator on the sheet are numbered #1, #2 ... from top to bottom, then left to right.)
C?#82  value 100uF  Case/Package: 1210  Voltage: 16V  Dielectric: X5R
C?#83  value 100nF  Case/Package: 0402  Voltage: 10V  Dielectric: X5R  [CAPC0402]
C?#84  value 22uF  Case/Package: 0805  Voltage: 25V  Dielectric: X5R  [capc0805]
C?#85  value 22uF  Case/Package: 0805  Voltage: 25V  Dielectric: X5R  [capc0805]
C?#86  value 22uF  Case/Package: 0805  Voltage: 25V  Dielectric: X5R  [capc0805]
C?#87  value 10uF  Case/Package: 0603  Voltage: 25V  Dielectric: X5R  [capc0603]
J?#1  C_DDR5_SODIMM_2X131_2EM  (value not drawn)  (part A of 3)
J?#2  C_DDR5_SODIMM_2X131_2EM  (value not drawn)  (part C of 3)
J?#3  C_DDR5_SODIMM_2X131_2EM  (value not drawn)  (part B of 3)
R?#50  value 15.4K  Case/Package: 0402  [RESC0402]  (hidden comment: Res)
R?#51  value 470E  Case/Package: 0402  [RESC0402]  (hidden comment: Res)
R?#52  value 0E  Case/Package: 0402  [RESC0402]  (hidden comment: Res)

### Ports
DDR5_C1_0_CA0 (in), DDR5_C1_0_CA1 (in), DDR5_C1_0_CA2 (in), DDR5_C1_0_CA3 (in), DDR5_C1_0_CA4 (in), DDR5_C1_0_CA5 (in), DDR5_C1_0_CA6 (in), DDR5_C1_0_CA7 (in), DDR5_C1_0_CA8 (in), DDR5_C1_0_CA9 (in), DDR5_C1_0_CA10 (in), DDR5_C1_0_CA11 (in), DDR5_C1_0_CA12 (in), DDR5_C1_0_CK2_DN (in), DDR5_C1_0_CK2_DP (in), DDR5_C1_0_CK3_DN (in), DDR5_C1_0_CK3_DP (in), DDR5_C1_0_CS2_N (in), DDR5_C1_0_CS3_N (in), DDR5_C1_0_DQ0_0 (bidir), DDR5_C1_0_DQ0_1 (bidir), DDR5_C1_0_DQ0_2 (bidir), DDR5_C1_0_DQ0_3 (bidir), DDR5_C1_0_DQ0_4 (bidir), DDR5_C1_0_DQ0_5 (bidir), DDR5_C1_0_DQ0_6 (bidir), DDR5_C1_0_DQ0_7 (bidir), DDR5_C1_0_DQ1_0 (bidir), DDR5_C1_0_DQ1_1 (bidir), DDR5_C1_0_DQ1_2 (bidir), DDR5_C1_0_DQ1_3 (bidir), DDR5_C1_0_DQ1_4 (bidir), DDR5_C1_0_DQ1_5 (bidir), DDR5_C1_0_DQ1_6 (bidir), DDR5_C1_0_DQ1_7 (bidir), DDR5_C1_0_DQ2_0 (bidir), DDR5_C1_0_DQ2_1 (bidir), DDR5_C1_0_DQ2_2 (bidir), DDR5_C1_0_DQ2_3 (bidir), DDR5_C1_0_DQ2_4 (bidir), DDR5_C1_0_DQ2_5 (bidir), DDR5_C1_0_DQ2_6 (bidir), DDR5_C1_0_DQ2_7 (bidir), DDR5_C1_0_DQ3_0 (bidir), DDR5_C1_0_DQ3_1 (bidir), DDR5_C1_0_DQ3_2 (bidir), DDR5_C1_0_DQ3_3 (bidir), DDR5_C1_0_DQ3_4 (bidir), DDR5_C1_0_DQ3_5 (bidir), DDR5_C1_0_DQ3_6 (bidir), DDR5_C1_0_DQ3_7 (bidir), DDR5_C1_0_DQ4_0 (bidir), DDR5_C1_0_DQ4_1 (bidir), DDR5_C1_0_DQ4_2 (bidir), DDR5_C1_0_DQ4_3 (bidir), DDR5_C1_0_DQS0_DN (bidir), DDR5_C1_0_DQS0_DP (bidir), DDR5_C1_0_DQS1_DN (bidir), DDR5_C1_0_DQS1_DP (bidir), DDR5_C1_0_DQS2_DN (bidir), DDR5_C1_0_DQS2_DP (bidir), DDR5_C1_0_DQS3_DN (bidir), DDR5_C1_0_DQS3_DP (bidir), DDR5_C1_0_DQS4_DN (bidir), DDR5_C1_0_DQS4_DP (bidir), DDR5_C1_1_CA0 (in), DDR5_C1_1_CA1 (in), DDR5_C1_1_CA2 (in), DDR5_C1_1_CA3 (in), DDR5_C1_1_CA4 (in), DDR5_C1_1_CA5 (in), DDR5_C1_1_CA6 (in), DDR5_C1_1_CA7 (in), DDR5_C1_1_CA8 (in), DDR5_C1_1_CA9 (in), DDR5_C1_1_CA10 (in), DDR5_C1_1_CA11 (in), DDR5_C1_1_CA12 (in), DDR5_C1_1_CK2_DN (in), DDR5_C1_1_CK2_DP (in), DDR5_C1_1_CK3_DN (in), DDR5_C1_1_CK3_DP (in), DDR5_C1_1_CS2_N (in), DDR5_C1_1_CS3_N (in), DDR5_C1_1_DQ0_0 (bidir), DDR5_C1_1_DQ0_1 (bidir), DDR5_C1_1_DQ0_2 (bidir), DDR5_C1_1_DQ0_3 (bidir), DDR5_C1_1_DQ0_4 (bidir), DDR5_C1_1_DQ0_5 (bidir), DDR5_C1_1_DQ0_6 (bidir), DDR5_C1_1_DQ0_7 (bidir), DDR5_C1_1_DQ1_0 (bidir), DDR5_C1_1_DQ1_1 (bidir), DDR5_C1_1_DQ1_2 (bidir), DDR5_C1_1_DQ1_3 (bidir), DDR5_C1_1_DQ1_4 (bidir), DDR5_C1_1_DQ1_5 (bidir), DDR5_C1_1_DQ1_6 (bidir), DDR5_C1_1_DQ1_7 (bidir), DDR5_C1_1_DQ2_0 (bidir), DDR5_C1_1_DQ2_1 (bidir), DDR5_C1_1_DQ2_2 (bidir), DDR5_C1_1_DQ2_3 (bidir), DDR5_C1_1_DQ2_4 (bidir), DDR5_C1_1_DQ2_5 (bidir), DDR5_C1_1_DQ2_6 (bidir), DDR5_C1_1_DQ2_7 (bidir), DDR5_C1_1_DQ3_0 (bidir), DDR5_C1_1_DQ3_1 (bidir), DDR5_C1_1_DQ3_2 (bidir), DDR5_C1_1_DQ3_3 (bidir), DDR5_C1_1_DQ3_4 (bidir), DDR5_C1_1_DQ3_5 (bidir), DDR5_C1_1_DQ3_6 (bidir), DDR5_C1_1_DQ3_7 (bidir), DDR5_C1_1_DQ4_0 (bidir), DDR5_C1_1_DQ4_1 (bidir), DDR5_C1_1_DQ4_2 (bidir), DDR5_C1_1_DQ4_3 (bidir), DDR5_C1_1_DQS0_DN (bidir), DDR5_C1_1_DQS0_DP (bidir), DDR5_C1_1_DQS1_DN (bidir), DDR5_C1_1_DQS1_DP (bidir), DDR5_C1_1_DQS2_DN (bidir), DDR5_C1_1_DQS2_DP (bidir), DDR5_C1_1_DQS3_DN (bidir), DDR5_C1_1_DQS3_DP (bidir), DDR5_C1_1_DQS4_DN (bidir), DDR5_C1_1_DQS4_DP (bidir), DDR5_C1_ALERT_N (out), DDR5_C1_ALERT_R_N (out), DDR5_PWR_EN (in), DDR5_PWR_GOOD (out), DDR5_RESET_N (in), DRAM_CLK (in), DRAM_DATA (bidir)

### Nets
+V5A_DDR5: C?#82.1 C?#84.1 C?#85.1 C?#86.1 C?#87.1 J?#2.1(VIN_BULK_1) J?#2.3(VIN_BULK_3)
+VCCDD2_PROC: R?#51.2
GND: C?#82.2 C?#83.2 C?#84.2 C?#85.2 C?#86.2 C?#87.2 J?#1.19(DM0_A_N) J?#1.42(DM1_A_N) J?#1.61(DM2_A_N) J?#1.84(DM3_A_N) J?#2.9(VSS_9) J?#2.10(VSS_10) J?#2.13(VSS_13) J?#2.14(VSS_14) J?#2.17(VSS_17) J?#2.18(VSS_18) J?#2.21(VSS_21) J?#2.24(VSS_24) J?#2.25(VSS_25) J?#2.28(VSS_28) J?#2.29(VSS_29) J?#2.32(VSS_32) J?#2.33(VSS_33) J?#2.36(VSS_36) J?#2.37(VSS_37) J?#2.40(VSS_40) J?#2.43(VSS_43) J?#2.44(VSS_44) J?#2.47(VSS_47) J?#2.48(VSS_48) J?#2.51(VSS_51) J?#2.52(VSS_52) J?#2.55(VSS_55) J?#2.56(VSS_56) J?#2.59(VSS_59) J?#2.60(VSS_60) J?#2.63(VSS_63) J?#2.66(VSS_66) J?#2.67(VSS_67) J?#2.70(VSS_70) J?#2.71(VSS_71) J?#2.74(VSS_74) J?#2.75(VSS_75) J?#2.78(VSS_78) J?#2.79(VSS_79) J?#2.82(VSS_82) J?#2.85(VSS_85) J?#2.86(VSS_86) J?#2.89(VSS_89) J?#2.90(VSS_90) J?#2.93(VSS_93) J?#2.94(VSS_94) J?#2.97(VSS_97) J?#2.98(VSS_98) J?#2.101(VSS_101) J?#2.104(VSS_104) J?#2.105(VSS_105) J?#2.111(VSS_111) J?#2.112(VSS_112) J?#2.117(VSS_117) J?#2.118(VSS_118) J?#2.123(VSS_123) J?#2.124(VSS_124) J?#2.129(VSS_129) J?#2.130(VSS_130) J?#2.135(VSS_135) J?#2.136(VSS_136) J?#2.141(VSS_141) J?#2.142(VSS_142) J?#2.147(VSS_147) J?#2.148(VSS_148) J?#2.153(VSS_153) J?#2.154(VSS_154) J?#2.159(VSS_159) J?#2.160(VSS_160) J?#2.166(VSS_166) J?#2.167(VSS_167) J?#2.170(VSS_170) J?#2.173(VSS_173) J?#2.174(VSS_174) J?#2.177(VSS_177) J?#2.178(VSS_178) J?#2.181(VSS_181) J?#2.182(VSS_182) J?#2.185(VSS_185) J?#2.186(VSS_186) J?#2.189(VSS_189) J?#2.192(VSS_192) J?#2.193(VSS_193) J?#2.196(VSS_196) J?#2.197(VSS_197) J?#2.200(VSS_200) J?#2.201(VSS_201) J?#2.204(VSS_204) J?#2.205(VSS_205) J?#2.208(VSS_208) J?#2.211(VSS_211) J?#2.212(VSS_212) J?#2.215(VSS_215) J?#2.216(VSS_216) J?#2.219(VSS_219) J?#2.220(VSS_220) J?#2.223(VSS_223) J?#2.224(VSS_224) J?#2.227(VSS_227) J?#2.228(VSS_228) J?#2.231(VSS_231) J?#2.234(VSS_234) J?#2.235(VSS_235) J?#2.238(VSS_238) J?#2.239(VSS_239) J?#2.242(VSS_242) J?#2.243(VSS_243) J?#2.246(VSS_246) J?#2.247(VSS_247) J?#2.250(VSS_250) J?#2.253(VSS_253) J?#2.254(VSS_254) J?#2.257(VSS_257) J?#2.258(VSS_258) J?#2.261(VSS_261) J?#2.262(VSS_262) J?#2.MH1 J?#2.MH2 J?#3.187(DM0_B_N) J?#3.210(DM1_B_N) J?#3.229(DM2_B_N) J?#3.252(DM3_B_N) R?#50.2  [project net EXP_A_RX_4_DP]
DDR5_C1_0_CA0: J?#1.107(CA0_A) ; port DDR5_C1_0_CA0
DDR5_C1_0_CA1: J?#1.109(CA1_A) ; port DDR5_C1_0_CA1
DDR5_C1_0_CA2: J?#1.113(CA2_A) ; port DDR5_C1_0_CA2
DDR5_C1_0_CA3: J?#1.114(CA3_A) ; port DDR5_C1_0_CA3
DDR5_C1_0_CA4: J?#1.115(CA4_A) ; port DDR5_C1_0_CA4
DDR5_C1_0_CA5: J?#1.116(CA5_A) ; port DDR5_C1_0_CA5
DDR5_C1_0_CA6: J?#1.119(CA6_A) ; port DDR5_C1_0_CA6
DDR5_C1_0_CA7: J?#1.120(CA7_A) ; port DDR5_C1_0_CA7
DDR5_C1_0_CA8: J?#1.121(CA8_A) ; port DDR5_C1_0_CA8
DDR5_C1_0_CA9: J?#1.122(CA9_A) ; port DDR5_C1_0_CA9
DDR5_C1_0_CA10: J?#1.125(CA10_A) ; port DDR5_C1_0_CA10
DDR5_C1_0_CA11: J?#1.126(CA11_A) ; port DDR5_C1_0_CA11
DDR5_C1_0_CA12: J?#1.127(CA12_A) ; port DDR5_C1_0_CA12
DDR5_C1_0_CK2_DN: J?#1.133(CK0_AN) ; port DDR5_C1_0_CK2_DN
DDR5_C1_0_CK2_DP: J?#1.131(CK0_AP) ; port DDR5_C1_0_CK2_DP
DDR5_C1_0_CK3_DN: J?#1.134(CK1_AN) ; port DDR5_C1_0_CK3_DN
DDR5_C1_0_CK3_DP: J?#1.132(CK1_AP) ; port DDR5_C1_0_CK3_DP
DDR5_C1_0_CS2_N: J?#1.106(CS0_A_N) ; port DDR5_C1_0_CS2_N
DDR5_C1_0_CS3_N: J?#1.110(CS1_A_N) ; port DDR5_C1_0_CS3_N
DDR5_C1_0_DQ0_0: J?#1.12(DQ1_A) ; port DDR5_C1_0_DQ0_0
DDR5_C1_0_DQ0_1: J?#1.11(DQ0_A) ; port DDR5_C1_0_DQ0_1
DDR5_C1_0_DQ0_2: J?#1.16(DQ3_A) ; port DDR5_C1_0_DQ0_2
DDR5_C1_0_DQ0_3: J?#1.15(DQ2_A) ; port DDR5_C1_0_DQ0_3
DDR5_C1_0_DQ0_4: J?#1.26(DQ5_A) ; port DDR5_C1_0_DQ0_4
DDR5_C1_0_DQ0_5: J?#1.23(DQ4_A) ; port DDR5_C1_0_DQ0_5
DDR5_C1_0_DQ0_6: J?#1.30(DQ7_A) ; port DDR5_C1_0_DQ0_6
DDR5_C1_0_DQ0_7: J?#1.27(DQ6_A) ; port DDR5_C1_0_DQ0_7
DDR5_C1_0_DQ1_0: J?#1.34(DQ09_A) ; port DDR5_C1_0_DQ1_0
DDR5_C1_0_DQ1_1: J?#1.31(DQ8_A) ; port DDR5_C1_0_DQ1_1
DDR5_C1_0_DQ1_2: J?#1.38(DQ11_A) ; port DDR5_C1_0_DQ1_2
DDR5_C1_0_DQ1_3: J?#1.35(DQ10_A) ; port DDR5_C1_0_DQ1_3
DDR5_C1_0_DQ1_4: J?#1.46(DQ13_A) ; port DDR5_C1_0_DQ1_4
DDR5_C1_0_DQ1_5: J?#1.45(DQ12_A) ; port DDR5_C1_0_DQ1_5
DDR5_C1_0_DQ1_6: J?#1.50(DQ15_A) ; port DDR5_C1_0_DQ1_6
DDR5_C1_0_DQ1_7: J?#1.49(DQ14_A) ; port DDR5_C1_0_DQ1_7
DDR5_C1_0_DQ2_0: J?#1.54(DQ17_A) ; port DDR5_C1_0_DQ2_0
DDR5_C1_0_DQ2_1: J?#1.53(DQ16_A) ; port DDR5_C1_0_DQ2_1
DDR5_C1_0_DQ2_2: J?#1.58(DQ19_A) ; port DDR5_C1_0_DQ2_2
DDR5_C1_0_DQ2_3: J?#1.57(DQ18_A) ; port DDR5_C1_0_DQ2_3
DDR5_C1_0_DQ2_4: J?#1.68(DQ21_A) ; port DDR5_C1_0_DQ2_4
DDR5_C1_0_DQ2_5: J?#1.65(DQ20_A) ; port DDR5_C1_0_DQ2_5
DDR5_C1_0_DQ2_6: J?#1.72(DQ23_A) ; port DDR5_C1_0_DQ2_6
DDR5_C1_0_DQ2_7: J?#1.69(DQ22_A) ; port DDR5_C1_0_DQ2_7
DDR5_C1_0_DQ3_0: J?#1.76(DQ25_A) ; port DDR5_C1_0_DQ3_0
DDR5_C1_0_DQ3_1: J?#1.73(DQ24_A) ; port DDR5_C1_0_DQ3_1
DDR5_C1_0_DQ3_2: J?#1.80(DQ27_A) ; port DDR5_C1_0_DQ3_2
DDR5_C1_0_DQ3_3: J?#1.77(DQ26_A) ; port DDR5_C1_0_DQ3_3
DDR5_C1_0_DQ3_4: J?#1.88(DQ29_A) ; port DDR5_C1_0_DQ3_4
DDR5_C1_0_DQ3_5: J?#1.87(DQ28_A) ; port DDR5_C1_0_DQ3_5
DDR5_C1_0_DQ3_6: J?#1.92(DQ31_A) ; port DDR5_C1_0_DQ3_6
DDR5_C1_0_DQ3_7: J?#1.91(DQ30_A) ; port DDR5_C1_0_DQ3_7
DDR5_C1_0_DQ4_0: J?#1.103(CB3_A) ; port DDR5_C1_0_DQ4_0
DDR5_C1_0_DQ4_1: J?#1.99(CB2_A) ; port DDR5_C1_0_DQ4_1
DDR5_C1_0_DQ4_2: J?#1.95(CB0_A) ; port DDR5_C1_0_DQ4_2
DDR5_C1_0_DQ4_3: J?#1.96(CB1_A) ; port DDR5_C1_0_DQ4_3
DDR5_C1_0_DQS0_DN: J?#1.20(DQS0_AN) ; port DDR5_C1_0_DQS0_DN
DDR5_C1_0_DQS0_DP: J?#1.22(DQS0_AP) ; port DDR5_C1_0_DQS0_DP
DDR5_C1_0_DQS1_DN: J?#1.39(DQS1_AN) ; port DDR5_C1_0_DQS1_DN
DDR5_C1_0_DQS1_DP: J?#1.41(DQS1_AP) ; port DDR5_C1_0_DQS1_DP
DDR5_C1_0_DQS2_DN: J?#1.62(DQS2_AN) ; port DDR5_C1_0_DQS2_DN
DDR5_C1_0_DQS2_DP: J?#1.64(DQS2_AP) ; port DDR5_C1_0_DQS2_DP
DDR5_C1_0_DQS3_DN: J?#1.81(DQS3_AN) ; port DDR5_C1_0_DQS3_DN
DDR5_C1_0_DQS3_DP: J?#1.83(DQS3_AP) ; port DDR5_C1_0_DQS3_DP
DDR5_C1_0_DQS4_DN: J?#1.100(DQS4_AN) ; port DDR5_C1_0_DQS4_DN
DDR5_C1_0_DQS4_DP: J?#1.102(DQS4_AP) ; port DDR5_C1_0_DQS4_DP
DDR5_C1_1_CA0: J?#3.164(CA0_B) ; port DDR5_C1_1_CA0
DDR5_C1_1_CA1: J?#3.162(CA1_B) ; port DDR5_C1_1_CA1
DDR5_C1_1_CA2: J?#3.158(CA2_B) ; port DDR5_C1_1_CA2
DDR5_C1_1_CA3: J?#3.157(CA3_B) ; port DDR5_C1_1_CA3
DDR5_C1_1_CA4: J?#3.156(CA4_B) ; port DDR5_C1_1_CA4
DDR5_C1_1_CA5: J?#3.155(CA5_B) ; port DDR5_C1_1_CA5
DDR5_C1_1_CA6: J?#3.152(CA6_B) ; port DDR5_C1_1_CA6
DDR5_C1_1_CA7: J?#3.151(CA7_B) ; port DDR5_C1_1_CA7
DDR5_C1_1_CA8: J?#3.150(CA8_B) ; port DDR5_C1_1_CA8
DDR5_C1_1_CA9: J?#3.149(CA9_B) ; port DDR5_C1_1_CA9
DDR5_C1_1_CA10: J?#3.146(CA10_B) ; port DDR5_C1_1_CA10
DDR5_C1_1_CA11: J?#3.145(CA11_B) ; port DDR5_C1_1_CA11
DDR5_C1_1_CA12: J?#3.144(CA12_B) ; port DDR5_C1_1_CA12
DDR5_C1_1_CK2_DN: J?#3.139(CK0_BN) ; port DDR5_C1_1_CK2_DN
DDR5_C1_1_CK2_DP: J?#3.137(CK0_BP) ; port DDR5_C1_1_CK2_DP
DDR5_C1_1_CK3_DN: J?#3.140(CK1_BN) ; port DDR5_C1_1_CK3_DN
DDR5_C1_1_CK3_DP: J?#3.138(CK1_BP) ; port DDR5_C1_1_CK3_DP
DDR5_C1_1_CS2_N: J?#3.161(CS0_B_N) ; port DDR5_C1_1_CS2_N
DDR5_C1_1_CS3_N: J?#3.165(CS1_B_N) ; port DDR5_C1_1_CS3_N
DDR5_C1_1_DQ0_0: J?#3.180(DQ1_B) ; port DDR5_C1_1_DQ0_0
DDR5_C1_1_DQ0_1: J?#3.179(DQ0_B) ; port DDR5_C1_1_DQ0_1
DDR5_C1_1_DQ0_2: J?#3.184(DQ3_B) ; port DDR5_C1_1_DQ0_2
DDR5_C1_1_DQ0_3: J?#3.183(DQ2_B) ; port DDR5_C1_1_DQ0_3
DDR5_C1_1_DQ0_4: J?#3.194(DQ5_B) ; port DDR5_C1_1_DQ0_4
DDR5_C1_1_DQ0_5: J?#3.191(DQ4_B) ; port DDR5_C1_1_DQ0_5
DDR5_C1_1_DQ0_6: J?#3.198(DQ7_B) ; port DDR5_C1_1_DQ0_6
DDR5_C1_1_DQ0_7: J?#3.195(DQ6_B) ; port DDR5_C1_1_DQ0_7
DDR5_C1_1_DQ1_0: J?#3.202(DQ9_B) ; port DDR5_C1_1_DQ1_0
DDR5_C1_1_DQ1_1: J?#3.199(DQ8_B) ; port DDR5_C1_1_DQ1_1
DDR5_C1_1_DQ1_2: J?#3.206(DQ11_B) ; port DDR5_C1_1_DQ1_2
DDR5_C1_1_DQ1_3: J?#3.203(DQ10_B) ; port DDR5_C1_1_DQ1_3
DDR5_C1_1_DQ1_4: J?#3.214(DQ13_B) ; port DDR5_C1_1_DQ1_4
DDR5_C1_1_DQ1_5: J?#3.213(DQ12_B) ; port DDR5_C1_1_DQ1_5
DDR5_C1_1_DQ1_6: J?#3.218(DQ15_B) ; port DDR5_C1_1_DQ1_6
DDR5_C1_1_DQ1_7: J?#3.217(DQ14_B) ; port DDR5_C1_1_DQ1_7
DDR5_C1_1_DQ2_0: J?#3.222(DQ17_B) ; port DDR5_C1_1_DQ2_0
DDR5_C1_1_DQ2_1: J?#3.221(DQ16_B) ; port DDR5_C1_1_DQ2_1
DDR5_C1_1_DQ2_2: J?#3.226(DQ19_B) ; port DDR5_C1_1_DQ2_2
DDR5_C1_1_DQ2_3: J?#3.225(DQ18_B) ; port DDR5_C1_1_DQ2_3
DDR5_C1_1_DQ2_4: J?#3.236(DQ21_B) ; port DDR5_C1_1_DQ2_4
DDR5_C1_1_DQ2_5: J?#3.233(DQ20_B) ; port DDR5_C1_1_DQ2_5
DDR5_C1_1_DQ2_6: J?#3.240(DQ23_B) ; port DDR5_C1_1_DQ2_6
DDR5_C1_1_DQ2_7: J?#3.237(DQ22_B) ; port DDR5_C1_1_DQ2_7
DDR5_C1_1_DQ3_0: J?#3.244(DQ25_B) ; port DDR5_C1_1_DQ3_0
DDR5_C1_1_DQ3_1: J?#3.241(DQ24_B) ; port DDR5_C1_1_DQ3_1
DDR5_C1_1_DQ3_2: J?#3.248(DQ27_B) ; port DDR5_C1_1_DQ3_2
DDR5_C1_1_DQ3_3: J?#3.245(DQ26_B) ; port DDR5_C1_1_DQ3_3
DDR5_C1_1_DQ3_4: J?#3.256(DQ29_B) ; port DDR5_C1_1_DQ3_4
DDR5_C1_1_DQ3_5: J?#3.255(DQ28_B) ; port DDR5_C1_1_DQ3_5
DDR5_C1_1_DQ3_6: J?#3.260(DQ31_B) ; port DDR5_C1_1_DQ3_6
DDR5_C1_1_DQ3_7: J?#3.259(DQ30_B) ; port DDR5_C1_1_DQ3_7
DDR5_C1_1_DQ4_0: J?#3.175(CB3_B) ; port DDR5_C1_1_DQ4_0
DDR5_C1_1_DQ4_1: J?#3.176(CB2_B) ; port DDR5_C1_1_DQ4_1
DDR5_C1_1_DQ4_2: J?#3.168(CB0_B) ; port DDR5_C1_1_DQ4_2
DDR5_C1_1_DQ4_3: J?#3.172(CB1_B) ; port DDR5_C1_1_DQ4_3
DDR5_C1_1_DQS0_DN: J?#3.188(DQS0_BN) ; port DDR5_C1_1_DQS0_DN
DDR5_C1_1_DQS0_DP: J?#3.190(DQS0_BP) ; port DDR5_C1_1_DQS0_DP
DDR5_C1_1_DQS1_DN: J?#3.207(DQS1_BN) ; port DDR5_C1_1_DQS1_DN
DDR5_C1_1_DQS1_DP: J?#3.209(DQS1_BP) ; port DDR5_C1_1_DQS1_DP
DDR5_C1_1_DQS2_DN: J?#3.230(DQS2_BN) ; port DDR5_C1_1_DQS2_DN
DDR5_C1_1_DQS2_DP: J?#3.232(DQS2_BP) ; port DDR5_C1_1_DQS2_DP
DDR5_C1_1_DQS3_DN: J?#3.249(DQS3_BN) ; port DDR5_C1_1_DQS3_DN
DDR5_C1_1_DQS3_DP: J?#3.251(DQS3_BP) ; port DDR5_C1_1_DQS3_DP
DDR5_C1_1_DQS4_DN: J?#3.169(DQS4_BN) ; port DDR5_C1_1_DQS4_DN
DDR5_C1_1_DQS4_DP: J?#3.171(DQS4_BP) ; port DDR5_C1_1_DQS4_DP
DDR5_C1_ALERT_N: R?#52.2 ; port DDR5_C1_ALERT_N
DDR5_C1_ALERT_R_N: J?#1.108(ALERT_N) R?#51.1 R?#52.1 ; port DDR5_C1_ALERT_R_N
DDR5_PWR_EN: J?#2.8(PWR_EN) ; port DDR5_PWR_EN
DDR5_PWR_GOOD: J?#2.7(PWR_GOOD) ; port DDR5_PWR_GOOD
DDR5_RESET_N: C?#83.1 J?#2.163(RESET_N) ; port DDR5_RESET_N
DIMM1_C1_SA0: J?#2.2(HSA) R?#50.1
DRAM_CLK: J?#2.4(HSCL) ; port DRAM_CLK
DRAM_DATA: J?#2.6(HSDA) ; port DRAM_DATA

Not connected (* = marked no-connect by the designer): J?#2 5(RFU_5)* 128(RFU_128)* 143(RFU_143)*

### Notes on the sheet
- 8MM STANDARD DDR5 SODIMM CONNECTOR (TOP)
- (near R?#50) 3Bit HID = 011
- (near R?#50) CH1 DIMM1 = A6
- (near R?#50) DESIGN NOTE:
- CAD NOTE:
- PH CAPS - PLACE EACH PAIR NEAR TO EACH UDIMM VIN_BULK PINS
- DQ Bit swapping is allowed within the same byte.
- Byte Swapping is allowed within the same channel.
- SODIMM Top pin vs Bottom Pin Definition
- "Top" pins of the DDRS SODIMM have a longer relative propagation delay (~20ps or ~3mm) then the "Bottom" pins (same 20ps value applies to all connector heights). This extra delay must be accounted for when length matching when specified. Refer to length matching rules tor more details
- Refer: RPL_HX_PDG Page No. 198
- (in symbol C_DDR5_SODIMM_2X131_2EM, part A) 1 OF 3
- (in symbol C_DDR5_SODIMM_2X131_2EM, part B) 2 OF 3
- (in symbol C_DDR5_SODIMM_2X131_2EM, part C) 3 OF 3

### Library data of the parts
C?#82 = Cap: CAP CER 100uF 16V X5R 1210; DNP: DNP
C?#83 = Cap: CAP CER 100nF 10V X5R 0402; DNP: DNP
C?#84-C?#86 = Cap: CAP CER 22uF 25V X5R 0805
  C?#86: DNP: DNP
C?#87 = Cap: CAP CER 10uF 25V X5R 0603; DNP: DNP
R?#50 = Res: as R?#45 on sheet 0024_DDR5 SODIMM CONTRO
R?#51 = Res: Thick Film Resistor -  470ohm, 1%, 0402; DNP: DNP
R?#52 = Res: Thick Film Resistor -  0ohm, 1%, 0402
J?#1-J?#3 = C_DDR5_SODIMM_2X131_2EM: Manufacturer Part Number: *; Case/Package: *

## Sheet 0029_System_debug_conne.SchDoc
size A3
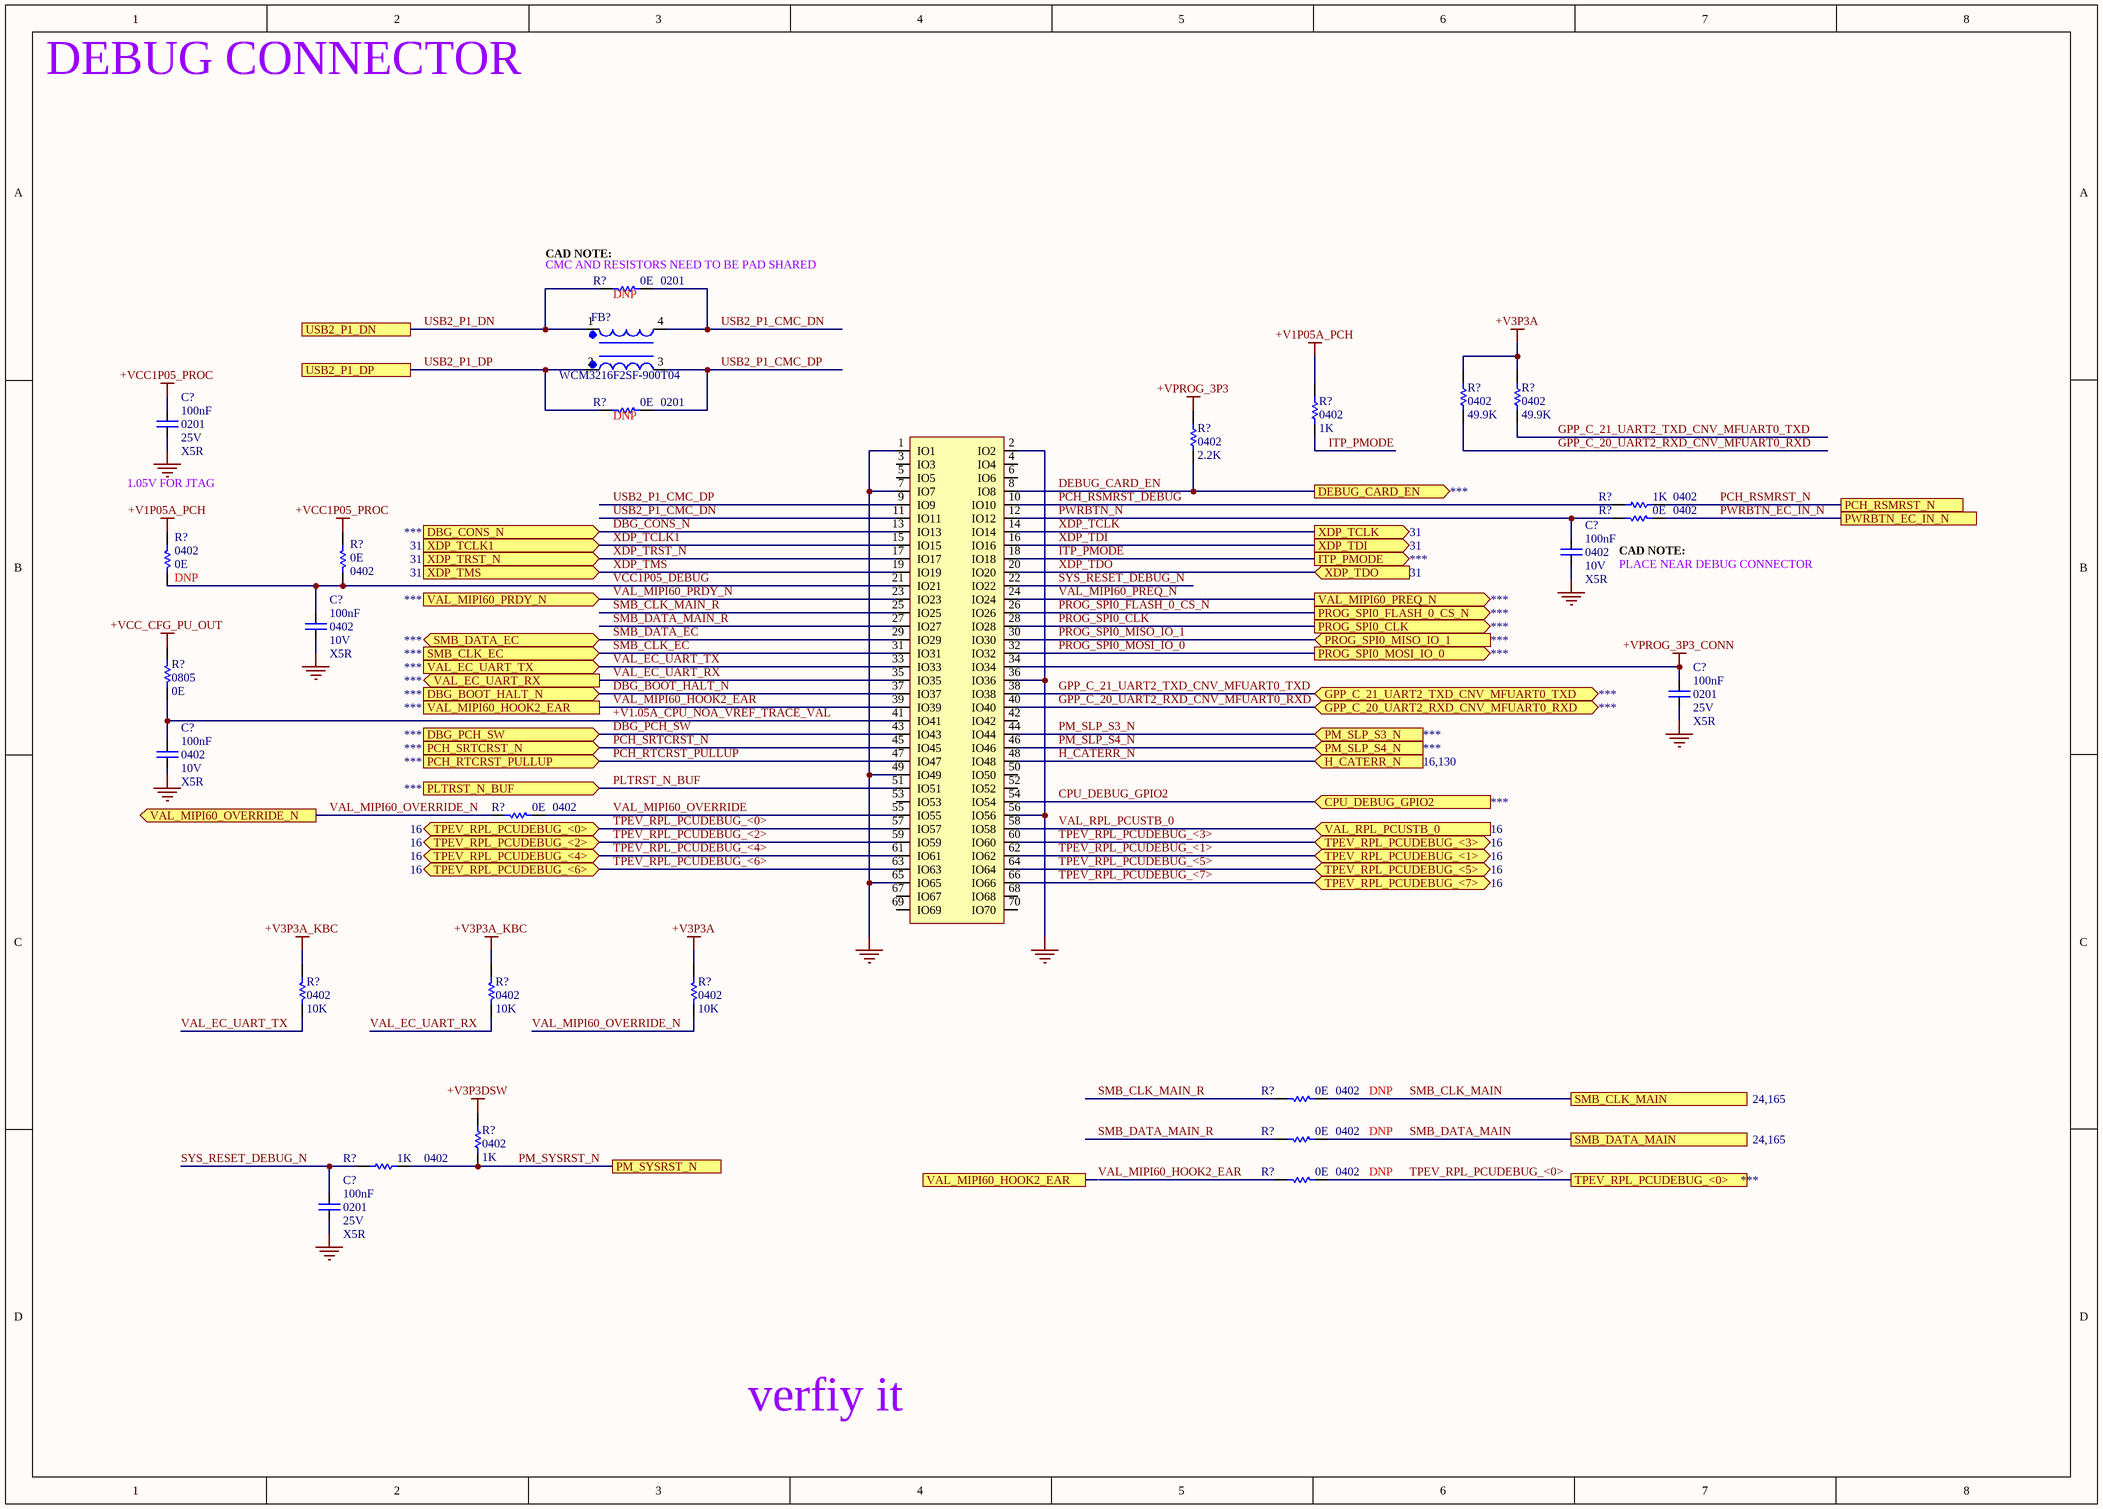
[diagram p51: 0029_System_debug_conne.SchDoc]

### Parts
(Parts that share a designator on the sheet are numbered #1, #2 ... from top to bottom, then left to right.)
C?#88  value 100nF  Case/Package: 0201  Voltage: 25V  Dielectric: X5R  [CAPC0201]
C?#89  value 100nF  Case/Package: 0402  Voltage: 10V  Dielectric: X5R  [CAPC0402]
C?#90  value 100nF  Case/Package: 0402  Voltage: 10V  Dielectric: X5R  [CAPC0402]
C?#91  value 100nF  Case/Package: 0201  Voltage: 25V  Dielectric: X5R  [CAPC0201]
C?#92  value 100nF  Case/Package: 0402  Voltage: 10V  Dielectric: X5R  [CAPC0402]
C?#93  value 100nF  Case/Package: 0201  Voltage: 25V  Dielectric: X5R  [CAPC0201]
FB?#1  WCM3216F2SF-900T04  [CHOKE]
J?#4  C_B2B_2X35  (value not drawn)
R?#53  value 0E  Case/Package: 0201  [RESC0201]  (hidden comment: Res)
R?#54  value 49.9K  Case/Package: 0402  [RESC0402]  (hidden comment: Res)
R?#55  value 49.9K  Case/Package: 0402  [RESC0402]  (hidden comment: Res)
R?#56  value 0E  Case/Package: 0201  [RESC0201]  (hidden comment: Res)
R?#57  value 1K  Case/Package: 0402  [RESC0402]  (hidden comment: Res)
R?#58  value 2.2K  Case/Package: 0402  [RESC0402]  (hidden comment: Res)
R?#59  value 1K  Case/Package: 0402  [RESC0402]  (hidden comment: Res)
R?#60  value 0E  Case/Package: 0402  [RESC0402]  (hidden comment: Res)
R?#61  value 0E  Case/Package: 0402  [RESC0402]  (hidden comment: Res)
R?#62  value 0E  Case/Package: 0402  [RESC0402]  (hidden comment: Res)
R?#63  value 0E  Case/Package: 0805  [RESC0805]  (hidden comment: Res)
R?#64  value 0E  Case/Package: 0402  [RESC0402]  (hidden comment: Res)
R?#65  value 10K  Case/Package: 0402  [RESC0402]  (hidden comment: Res)
R?#66  value 10K  Case/Package: 0402  [RESC0402]  (hidden comment: Res)
R?#67  value 10K  Case/Package: 0402  [RESC0402]  (hidden comment: Res)
R?#68  value 0E  Case/Package: 0402  [RESC0402]  (hidden comment: Res)
R?#69  value 1K  Case/Package: 0402  [RESC0402]  (hidden comment: Res)
R?#70  value 0E  Case/Package: 0402  [RESC0402]  (hidden comment: Res)
R?#71  value 1K  Case/Package: 0402  [RESC0402]  (hidden comment: Res)
R?#72  value 0E  Case/Package: 0402  [RESC0402]  (hidden comment: Res)

### Ports
CPU_DEBUG_GPIO2 (in), DBG_BOOT_HALT_N (in), DBG_CONS_N (in), DBG_PCH_SW (in), DEBUG_CARD_EN (out), GPP_C_20_UART2_RXD_CNV_MFUART0_RXD (bidir), GPP_C_21_UART2_TXD_CNV_MFUART0_TXD (bidir), H_CATERR_N (in), ITP_PMODE (out), PCH_RSMRST_N, PCH_RTCRST_PULLUP (in), PCH_SRTCRST_N (in), PLTRST_N_BUF (in), PM_SLP_S3_N (in), PM_SLP_S4_N (in), PM_SYSRST_N, PROG_SPI0_CLK (out), PROG_SPI0_FLASH_0_CS_N (out), PROG_SPI0_MISO_IO_1 (in), PROG_SPI0_MOSI_IO_0 (out), PWRBTN_EC_IN_N, SMB_CLK_EC (in), SMB_CLK_MAIN, SMB_DATA_EC (bidir), SMB_DATA_MAIN, TPEV_RPL_PCUDEBUG_<0>, TPEV_RPL_PCUDEBUG_<0> (bidir), TPEV_RPL_PCUDEBUG_<1> (bidir), TPEV_RPL_PCUDEBUG_<2> (bidir), TPEV_RPL_PCUDEBUG_<3> (bidir), TPEV_RPL_PCUDEBUG_<4> (bidir), TPEV_RPL_PCUDEBUG_<5> (bidir), TPEV_RPL_PCUDEBUG_<6> (bidir), TPEV_RPL_PCUDEBUG_<7> (bidir), USB2_P1_DN, USB2_P1_DP, VAL_EC_UART_RX (out), VAL_EC_UART_TX (in), VAL_MIPI60_HOOK2_EAR, VAL_MIPI60_OVERRIDE_N (out), VAL_MIPI60_PRDY_N (in), VAL_MIPI60_PREQ_N (out), VAL_RPL_PCUSTB_0 (in), XDP_TCLK1 (in), XDP_TCLK (out), XDP_TDI (out), XDP_TDO (in), XDP_TMS (in), XDP_TRST_N (in)

### Nets
+V1P05A_PCH: R?#57.2 R?#61.1
+V3P3A: R?#54.2 R?#55.2 R?#67.2
+V3P3A_KBC: R?#65.2 R?#66.2
+V3P3DSW: R?#69.2
+VCC1P05_PROC: C?#88.1 R?#62.1
+VCC_CFG_PU_OUT: R?#63.2
+VPROG_3P3: R?#58.2
+VPROG_3P3_CONN: C?#91.1 J?#4.34(IO34)
GND: C?#88.2 C?#89.2 C?#90.2 C?#91.2 C?#92.2 C?#93.2 J?#4.1(IO1) J?#4.2(IO2) J?#4.7(IO7) J?#4.36(IO36) J?#4.49(IO49) J?#4.56(IO56) J?#4.65(IO65)  [project net EXP_A_RX_4_DP]
+V1.05A_CPU_NOA_VREF_TRACE_VAL: C?#92.1 J?#4.41(IO41) R?#63.1
CPU_DEBUG_GPIO2: J?#4.54(IO54) ; port CPU_DEBUG_GPIO2
DBG_BOOT_HALT_N: J?#4.37(IO37) ; port DBG_BOOT_HALT_N
DBG_CONS_N: J?#4.13(IO13) ; port DBG_CONS_N
DBG_PCH_SW: J?#4.43(IO43) ; port DBG_PCH_SW
DEBUG_CARD_EN: J?#4.8(IO8) R?#58.1 ; port DEBUG_CARD_EN
GPP_C_20_UART2_RXD_CNV_MFUART0_RXD: J?#4.40(IO40) R?#54.1 ; port GPP_C_20_UART2_RXD_CNV_MFUART0_RXD
GPP_C_21_UART2_TXD_CNV_MFUART0_TXD: J?#4.38(IO38) R?#55.1 ; port GPP_C_21_UART2_TXD_CNV_MFUART0_TXD
H_CATERR_N: J?#4.48(IO48) ; port H_CATERR_N
ITP_PMODE: J?#4.18(IO18) R?#57.1 ; port ITP_PMODE
PCH_RSMRST_DEBUG: J?#4.10(IO10) R?#59.2
PCH_RSMRST_N: R?#59.1 ; port PCH_RSMRST_N
PCH_RTCRST_PULLUP: J?#4.47(IO47) ; port PCH_RTCRST_PULLUP
PCH_SRTCRST_N: J?#4.45(IO45) ; port PCH_SRTCRST_N
PLTRST_N_BUF: J?#4.51(IO51) ; port PLTRST_N_BUF
PM_SLP_S3_N: J?#4.44(IO44) ; port PM_SLP_S3_N
PM_SLP_S4_N: J?#4.46(IO46) ; port PM_SLP_S4_N
PM_SYSRST_N: R?#69.1 R?#71.1 ; port PM_SYSRST_N
PROG_SPI0_CLK: J?#4.28(IO28) ; port PROG_SPI0_CLK
PROG_SPI0_FLASH_0_CS_N: J?#4.26(IO26) ; port PROG_SPI0_FLASH_0_CS_N
PROG_SPI0_MISO_IO_1: J?#4.30(IO30) ; port PROG_SPI0_MISO_IO_1
PROG_SPI0_MOSI_IO_0: J?#4.32(IO32) ; port PROG_SPI0_MOSI_IO_0
PWRBTN_EC_IN_N: R?#60.2 ; port PWRBTN_EC_IN_N
PWRBTN_N: C?#89.1 J?#4.12(IO12) R?#60.1
SMB_CLK_EC: J?#4.31(IO31) ; port SMB_CLK_EC
SMB_CLK_MAIN: R?#68.2 ; port SMB_CLK_MAIN
SMB_CLK_MAIN_R: J?#4.25(IO25) R?#68.1
SMB_DATA_EC: J?#4.29(IO29) ; port SMB_DATA_EC
SMB_DATA_MAIN: R?#70.2 ; port SMB_DATA_MAIN
SMB_DATA_MAIN_R: J?#4.27(IO27) R?#70.1
SYS_RESET_DEBUG_N: C?#93.1 J?#4.22(IO22) R?#71.2
TPEV_RPL_PCUDEBUG_<0>: J?#4.57(IO57) R?#72.2 ; port TPEV_RPL_PCUDEBUG_<0>
TPEV_RPL_PCUDEBUG_<1>: J?#4.62(IO62) ; port TPEV_RPL_PCUDEBUG_<1>
TPEV_RPL_PCUDEBUG_<2>: J?#4.59(IO59) ; port TPEV_RPL_PCUDEBUG_<2>
TPEV_RPL_PCUDEBUG_<3>: J?#4.60(IO60) ; port TPEV_RPL_PCUDEBUG_<3>
TPEV_RPL_PCUDEBUG_<4>: J?#4.61(IO61) ; port TPEV_RPL_PCUDEBUG_<4>
TPEV_RPL_PCUDEBUG_<5>: J?#4.64(IO64) ; port TPEV_RPL_PCUDEBUG_<5>
TPEV_RPL_PCUDEBUG_<6>: J?#4.63(IO63) ; port TPEV_RPL_PCUDEBUG_<6>
TPEV_RPL_PCUDEBUG_<7>: J?#4.66(IO66) ; port TPEV_RPL_PCUDEBUG_<7>
USB2_P1_CMC_DN: FB?#1.4 J?#4.11(IO11) R?#53.2
USB2_P1_CMC_DP: FB?#1.3 J?#4.9(IO9) R?#56.2
USB2_P1_DN: FB?#1.1 R?#53.1 ; port USB2_P1_DN
USB2_P1_DP: FB?#1.2 R?#56.1 ; port USB2_P1_DP
VAL_EC_UART_RX: J?#4.35(IO35) R?#66.1 ; port VAL_EC_UART_RX
VAL_EC_UART_TX: J?#4.33(IO33) R?#65.1 ; port VAL_EC_UART_TX
VAL_MIPI60_HOOK2_EAR: J?#4.39(IO39) ; port VAL_MIPI60_HOOK2_EAR
VAL_MIPI60_OVERRIDE: J?#4.55(IO55) R?#64.2
VAL_MIPI60_OVERRIDE_N: R?#64.1 R?#67.1 ; port VAL_MIPI60_OVERRIDE_N
VAL_MIPI60_PRDY_N: J?#4.23(IO23) ; port VAL_MIPI60_PRDY_N
VAL_MIPI60_PREQ_N: J?#4.24(IO24) ; port VAL_MIPI60_PREQ_N
VAL_RPL_PCUSTB_0: J?#4.58(IO58) ; port VAL_RPL_PCUSTB_0
VCC1P05_DEBUG: C?#90.1 J?#4.21(IO21) R?#61.2 R?#62.2
XDP_TCLK: J?#4.14(IO14) ; port XDP_TCLK
XDP_TCLK1: J?#4.15(IO15) ; port XDP_TCLK1
XDP_TDI: J?#4.16(IO16) ; port XDP_TDI
XDP_TDO: J?#4.20(IO20) ; port XDP_TDO
XDP_TMS: J?#4.19(IO19) ; port XDP_TMS
XDP_TRST_N: J?#4.17(IO17) ; port XDP_TRST_N

Not connected (* = marked no-connect by the designer): J?#4 3(IO3) 4(IO4) 5(IO5) 6(IO6) 42(IO42) 50(IO50) 52(IO52) 53(IO53) 67(IO67) 68(IO68) 69(IO69) 70(IO70); R?#72 1

### Notes on the sheet
- DEBUG CONNECTOR
- (near R?#53) CAD NOTE:
- (near R?#53) CMC AND RESISTORS NEED TO BE PAD SHARED
- 1.05V FOR JTAG
- (near R?#60) CAD NOTE:
- PLACE NEAR DEBUG CONNECTOR
- verfiy it

### Library data of the parts
C?#88 C?#91 C?#93 = Cap: CAP CER 100nF 25V X5R 0201
C?#89 C?#90 C?#92 = Cap: CAP CER 100nF 10V X5R 0402
FB?#1 = WCM3216F2SF-900T04: Power, Signal Line 90 Ohms @ 100MHz 300 mOhm 50V SMD,3.2x1.6x2mm Common Mode Filters RoHS; Manufacturer Part Number: WCM3216F2SF-900T04; Case/Package: 3.2x1.6x2mm
R?#53 R?#56 = Res: Thick Film Resistor -  0ohm, 1%, 0201; DNP: DNP
R?#54 R?#55 = Res: Thick Film Resistor -  49.9Kohm, 1%, 0402
R?#57 R?#59 R?#69 R?#71 = Res: Thick Film Resistor -  1Kohm, 1%, 0402
R?#58 = Res: Thick Film Resistor -  2.2Kohm, 1%, 0402
R?#60-R?#62 R?#64 R?#68 R?#70 R?#72 = Res: Thick Film Resistor -  0ohm, 1%, 0402
  R?#61 R?#68 R?#70 R?#72: DNP: DNP
R?#63 = Res: Thick Film Resistor -  0ohm, 1%, 0805
R?#65-R?#67 = Res: Thick Film Resistor -  10Kohm, 1%, 0402
J?#4 = C_B2B_2X35: Manufacturer Part Number: *; Case/Package: *